# EAGLE schematic MotherboardRev2 (EAGLE 7.2.0)

## Sheet 1 of 12
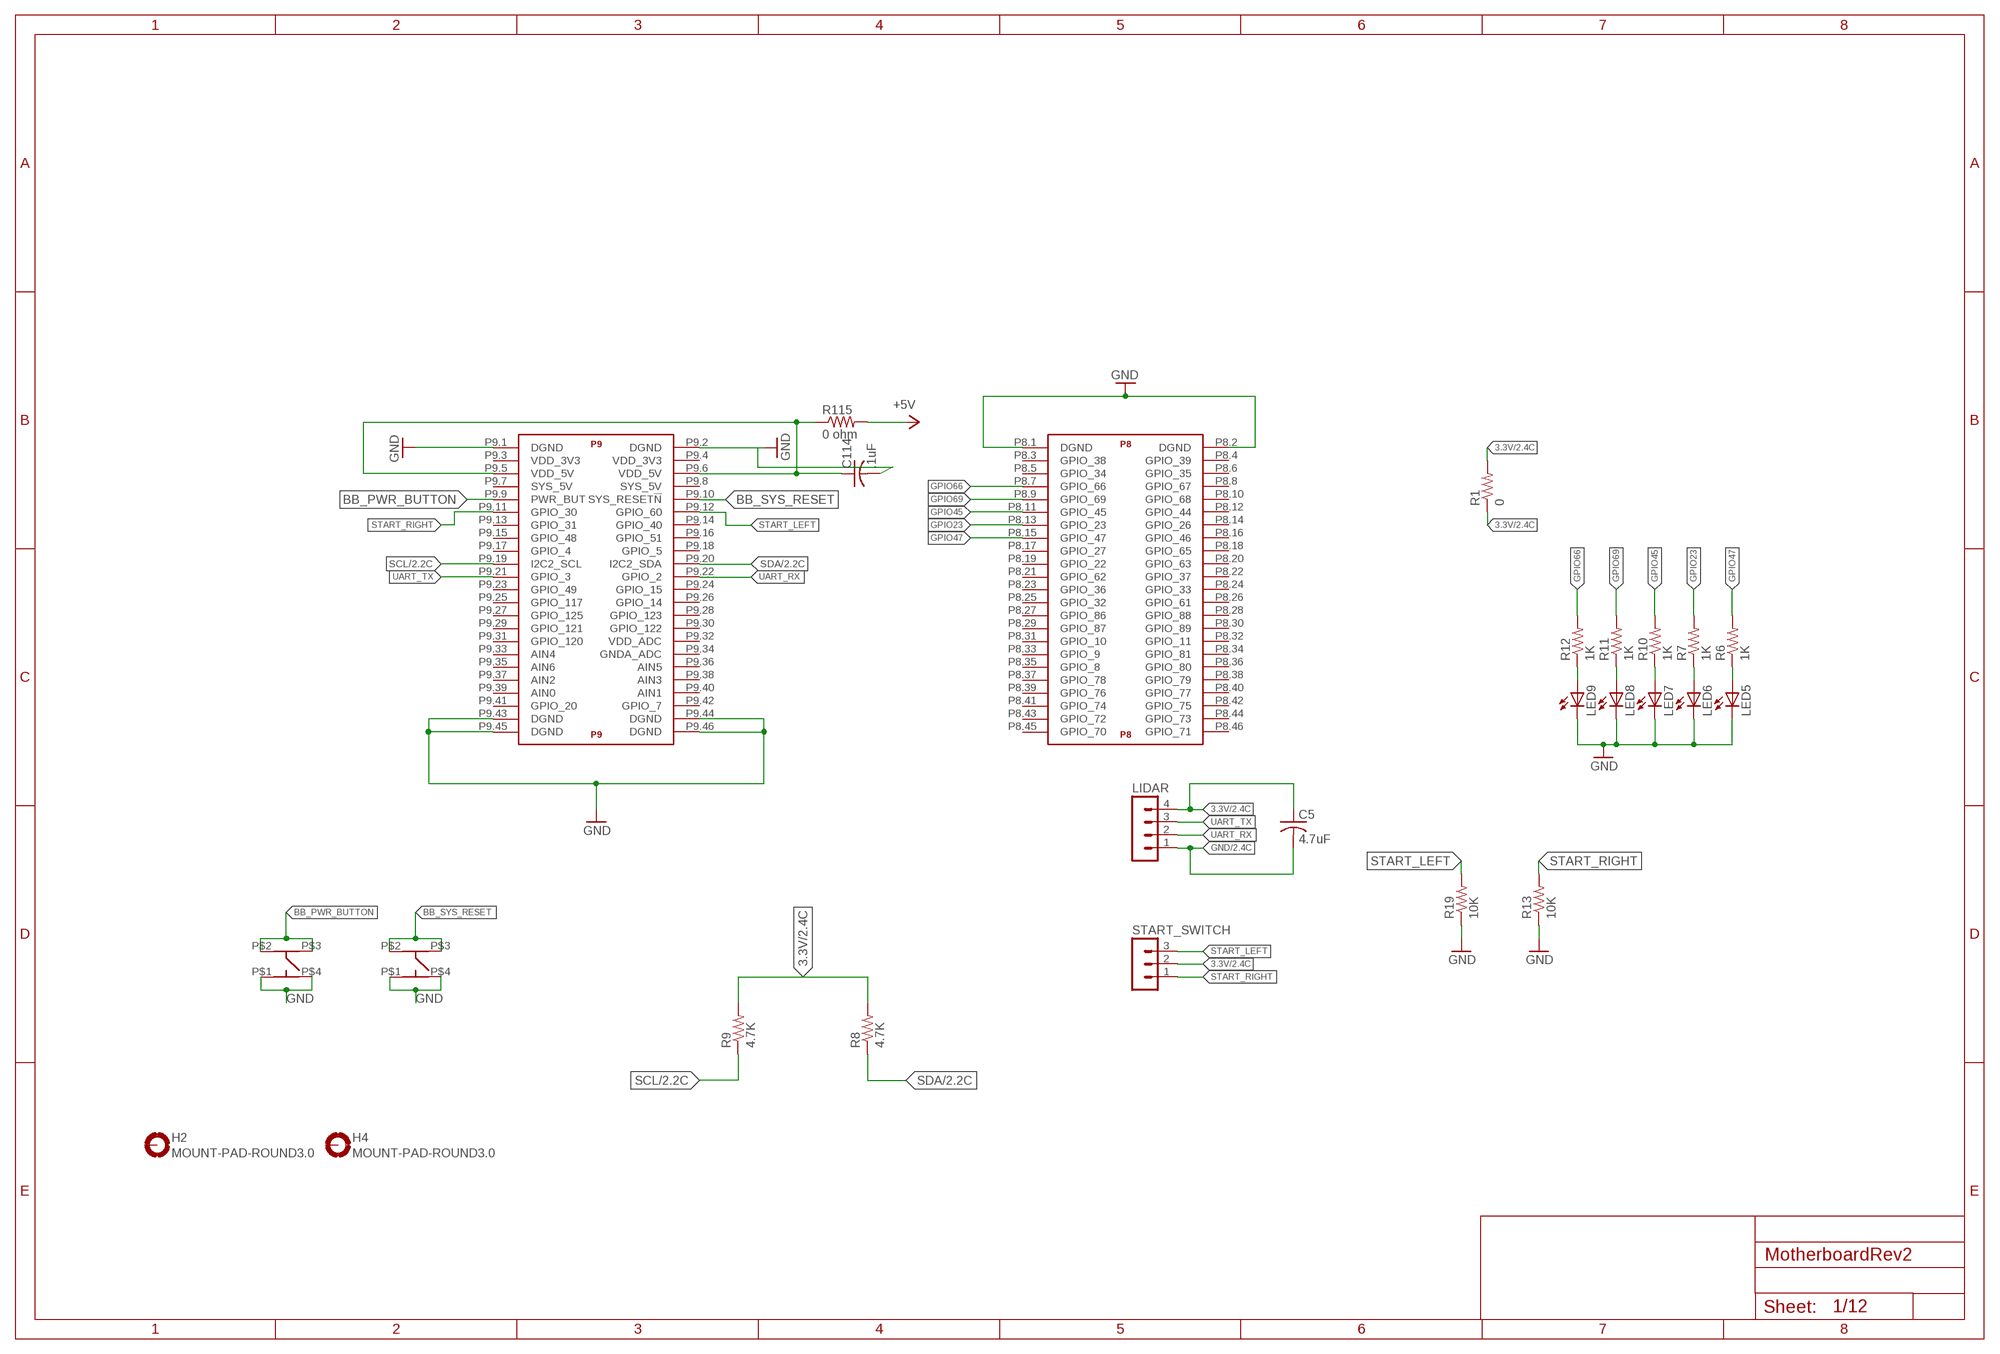
[diagram p0: schematic, sheet 1]

### Parts
C5  4.7uF  C-USC0402  [C0402]
C114  .1uF  C-USC0402  [C0402]
H2  MOUNT-PAD-ROUND3.0  [3,0-PAD]
H4  MOUNT-PAD-ROUND3.0  [3,0-PAD]
LED5  LEDCHIP-LED0603  [CHIP-LED0603]
LED6  LEDCHIP-LED0603  [CHIP-LED0603]
LED7  LEDCHIP-LED0603  [CHIP-LED0603]
LED8  LEDCHIP-LED0603  [CHIP-LED0603]
LED9  LEDCHIP-LED0603  [CHIP-LED0603]
LIDAR  MA04-1  [MA04-1]
R1  0  R-US_R0805  [R0805]
R6  1K  R-US_R0402  [R0402]
R7  1K  R-US_R0402  [R0402]
R8  4.7K  R-US_R0402  [R0402]
R9  4.7K  R-US_R0402  [R0402]
R10  1K  R-US_R0402  [R0402]
R11  1K  R-US_R0402  [R0402]
R12  1K  R-US_R0402  [R0402]
R13  10K  R-US_R0402  [R0402]
R19  10K  R-US_R0402  [R0402]
R115  0 ohm  R-US_R0805  [R0805]
START_SWITCH  MA03-1  [MA03-1]
U$5  BEAGLE_BONE_BLACK_CAPE  [BEAGLE_BONE_BLACK_CAPE]
U$100  Switch1  MC32882_SW  [MC32882_FINAL]
U$101  Switch1  MC32882_SW  [MC32882_FINAL]

### Nets
3.3V: C5.1 LIDAR.4 R1.1 R1.2 R8.2 R9.2 START_SWITCH.2 ; also sheet 2,3,9,10
BB_PWR_BUTTON: U$5.P9.9(P9:PWR_BUT) U$101.P$2(P2) U$101.P$3(P3)
BB_SYS_RESET: U$5.P9.10(P9:SYS_RESET!N) U$100.P$2(P2) U$100.P$3(P3)
GND: C5.2 C114.2 LED5.C LED6.C LED7.C LED8.C LED9.C LIDAR.1 R13.1 R19.1 U$5.P8.1(P8:DGND) U$5.P8.2(P8:DGND) U$5.P9.1(P9:DGND) U$5.P9.2(P9:DGND) U$5.P9.43(P9:DGND) U$5.P9.44(P9:DGND) U$5.P9.45(P9:DGND) U$5.P9.46(P9:DGND) U$100.P$1(P1) U$100.P$4(P4) U$101.P$1(P1) U$101.P$4(P4) ; also sheet 2,3,4,5,6,7,8,9,10,11
GPIO23: R7.2 U$5.P8.13(P8:GPIO_23)
GPIO45: R10.2 U$5.P8.11(P8:GPIO_45)
GPIO47: R6.2 U$5.P8.15(P8:GPIO_47)
GPIO66: R12.2 U$5.P8.7(P8:GPIO_66)
GPIO69: R11.2 U$5.P8.9(P8:GPIO_69)
N$18: C114.1 R115.1 U$5.P9.5(P9:VDD_5V) U$5.P9.6(P9:VDD_5V)
N$55: LED9.A R12.1
N$56: LED8.A R11.1
N$57: LED7.A R10.1
N$58: LED6.A R7.1
N$59: LED5.A R6.1
SCL: R9.1 U$5.P9.19(P9:I2C2_SCL) ; also sheet 2,10
SDA: R8.1 U$5.P9.20(P9:I2C2_SDA) ; also sheet 2,10
START_LEFT: R19.2 START_SWITCH.3 U$5.P9.12(P9:GPIO_60)
START_RIGHT: R13.2 START_SWITCH.1 U$5.P9.11(P9:GPIO_30)
UART_RX: LIDAR.2 U$5.P9.22(P9:GPIO_2)
UART_TX: LIDAR.3 U$5.P9.21(P9:GPIO_3)
VOUT1: R115.2 ; supply symbol labelled +5V ; also sheet 3,4,5
Unconnected: H2.B3,0(MOUNT) H4.B3,0(MOUNT) U$5.P8.3(P8:GPIO_38) U$5.P8.4(P8:GPIO_39) U$5.P8.5(P8:GPIO_34) U$5.P8.6(P8:GPIO_35) U$5.P8.8(P8:GPIO_67) U$5.P8.10(P8:GPIO_68) U$5.P8.12(P8:GPIO_44) U$5.P8.14(P8:GPIO_26) U$5.P8.16(P8:GPIO_46) U$5.P8.17(P8:GPIO_27) U$5.P8.18(P8:GPIO_65) U$5.P8.19(P8:GPIO_22) U$5.P8.20(P8:GPIO_63) U$5.P8.21(P8:GPIO_62) U$5.P8.22(P8:GPIO_37) U$5.P8.23(P8:GPIO_36) U$5.P8.24(P8:GPIO_33) U$5.P8.25(P8:GPIO_32) U$5.P8.26(P8:GPIO_61) U$5.P8.27(P8:GPIO_86) U$5.P8.28(P8:GPIO_88) U$5.P8.29(P8:GPIO_87) U$5.P8.30(P8:GPIO_89) U$5.P8.31(P8:GPIO_10) U$5.P8.32(P8:GPIO_11) U$5.P8.33(P8:GPIO_9) U$5.P8.34(P8:GPIO_81) U$5.P8.35(P8:GPIO_8) U$5.P8.36(P8:GPIO_80) U$5.P8.37(P8:GPIO_78) U$5.P8.38(P8:GPIO_79) U$5.P8.39(P8:GPIO_76) U$5.P8.40(P8:GPIO_77) U$5.P8.41(P8:GPIO_74) U$5.P8.42(P8:GPIO_75) U$5.P8.43(P8:GPIO_72) U$5.P8.44(P8:GPIO_73) U$5.P8.45(P8:GPIO_70) U$5.P8.46(P8:GPIO_71) U$5.P9.3(P9:VDD_3V3) U$5.P9.4(P9:VDD_3V3) U$5.P9.7(P9:SYS_5V) U$5.P9.8(P9:SYS_5V) U$5.P9.13(P9:GPIO_31) U$5.P9.14(P9:GPIO_40) U$5.P9.15(P9:GPIO_48) U$5.P9.16(P9:GPIO_51) U$5.P9.17(P9:GPIO_4) U$5.P9.18(P9:GPIO_5) U$5.P9.23(P9:GPIO_49) U$5.P9.24(P9:GPIO_15) U$5.P9.25(P9:GPIO_117) U$5.P9.26(P9:GPIO_14) U$5.P9.27(P9:GPIO_125) U$5.P9.28(P9:GPIO_123) U$5.P9.29(P9:GPIO_121) U$5.P9.30(P9:GPIO_122) U$5.P9.31(P9:GPIO_120) U$5.P9.32(P9:VDD_ADC) U$5.P9.33(P9:AIN4) U$5.P9.34(P9:GNDA_ADC) U$5.P9.35(P9:AIN6) U$5.P9.36(P9:AIN5) U$5.P9.37(P9:AIN2) U$5.P9.38(P9:AIN3) U$5.P9.39(P9:AIN0) U$5.P9.40(P9:AIN1) U$5.P9.41(P9:GPIO_20) U$5.P9.42(P9:GPIO_7)

## Sheet 2 of 12
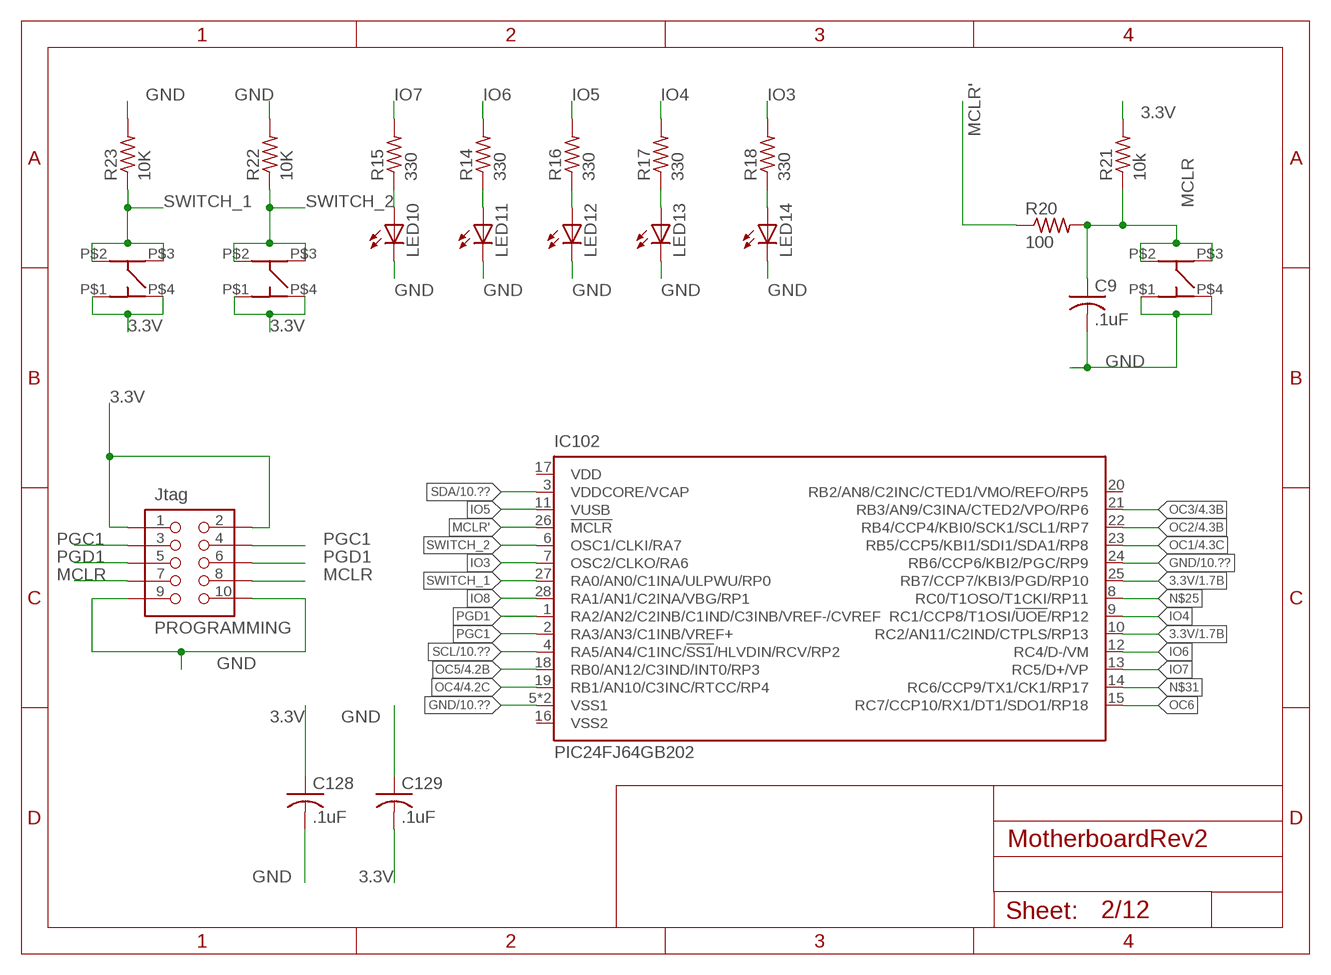
[diagram p1: schematic, sheet 2]

### Parts
C9  .1uF  C-USC0402  [C0402]
C128  .1uF  C-USC0402  [C0402]
C129  .1uF  C-USC0402  [C0402]
IC102  PIC24FJ64GB202  PIC18F26J53ML  [QFN28-ML_6X6MM]
LED10  LEDCHIP-LED0603  [CHIP-LED0603]
LED11  LEDCHIP-LED0603  [CHIP-LED0603]
LED12  LEDCHIP-LED0603  [CHIP-LED0603]
LED13  LEDCHIP-LED0603  [CHIP-LED0603]
LED14  LEDCHIP-LED0603  [CHIP-LED0603]
PROGRAMMING  Jtag  MOTHER-BOARD-REV5_PIN-CONNECTOR74089  [MOTHER-BOARD-REV5_10-PIN-SMD]
R14  330  R-US_R0402  [R0402]
R15  330  R-US_R0402  [R0402]
R16  330  R-US_R0402  [R0402]
R17  330  R-US_R0402  [R0402]
R18  330  R-US_R0402  [R0402]
R20  100  R-US_R0402  [R0402]
R21  10k  R-US_R0402  [R0402]
R22  10K  R-US_R0402  [R0402]
R23  10K  R-US_R0402  [R0402]
U$3  Switch2  MC32882_SW  [MC32882_FINAL]
U$4  Switch1  MC32882_SW  [MC32882_FINAL]
U$102  Switch3  MC32882_SW  [MC32882_FINAL]

### Nets
3.3V: C128.1 C129.1 IC102.10(RC2/AN11/C2IND/CTPLS/RP13) IC102.25(RB7/CCP7/KBI3/PGD/RP10) PROGRAMMING.1 PROGRAMMING.2 R21.2 U$3.P$1(P1) U$3.P$4(P4) U$4.P$1(P1) U$4.P$4(P4) ; also sheet 1,3,9,10
GND: C9.2 C128.2 C129.2 IC102.5(VSS1) IC102.24(RB6/CCP6/KBI2/PGC/RP9) IC102.EXP(VSS1) LED10.C LED11.C LED12.C LED13.C LED14.C PROGRAMMING.9 PROGRAMMING.10 R22.2 R23.2 U$102.P$1(P1) U$102.P$4(P4) ; also sheet 1,3,4,5,6,7,8,9,10,11
IO3: IC102.7(OSC2/CLKO/RA6) R18.2
IO4: IC102.9(RC1/CCP8/T1OSI/!UOE!/RP12) R17.2
IO5: IC102.11(VUSB) R16.2
IO6: IC102.12(RC4/D-/VM) R14.2
IO7: IC102.13(RC5/D+/VP) R15.2
IO8: IC102.28(RA1/AN1/C2INA/VBG/RP1)
MCLR: C9.1 PROGRAMMING.7 PROGRAMMING.8 R20.2 R21.1 U$102.P$2(P2) U$102.P$3(P3)
MCLR': IC102.26(!MCLR) R20.1
N$5: LED10.A R15.1
N$6: LED11.A R14.1
N$7: LED12.A R16.1
N$8: LED13.A R17.1
N$9: LED14.A R18.1
N$25: IC102.8(RC0/T1OSO/T1CKI/RP11)
N$31: IC102.14(RC6/CCP9/TX1/CK1/RP17)
OC1: IC102.23(RB5/CCP5/KBI1/SDI1/SDA1/RP8) ; also sheet 4
OC2: IC102.22(RB4/CCP4/KBI0/SCK1/SCL1/RP7) ; also sheet 4
OC3: IC102.21(RB3/AN9/C3INA/CTED2/VPO/RP6) ; also sheet 4
OC4: IC102.19(RB1/AN10/C3INC/RTCC/RP4) ; also sheet 4
OC5: IC102.18(RB0/AN12/C3IND/INT0/RP3) ; also sheet 4
OC6: IC102.15(RC7/CCP10/RX1/DT1/SDO1/RP18) ; also sheet 4
PGC1: IC102.2(RA3/AN3/C1INB/VREF+) PROGRAMMING.3 PROGRAMMING.4
PGD1: IC102.1(RA2/AN2/C2INB/C1IND/C3INB/VREF-/CVREF) PROGRAMMING.5 PROGRAMMING.6
SCL: IC102.4(RA5/AN4/C1INC/!SS1!/HLVDIN/RCV/RP2) ; also sheet 1,10
SDA: IC102.3(VDDCORE/VCAP) ; also sheet 1,10
SWITCH_1: IC102.27(RA0/AN0/C1INA/ULPWU/RP0) R23.1 U$4.P$2(P2) U$4.P$3(P3)
SWITCH_2: IC102.6(OSC1/CLKI/RA7) R22.1 U$3.P$2(P2) U$3.P$3(P3)
Unconnected: IC102.16(VSS2) IC102.17(VDD) IC102.20(RB2/AN8/C2INC/CTED1/VMO/REFO/RP5)

## Sheet 3 of 12: Power System
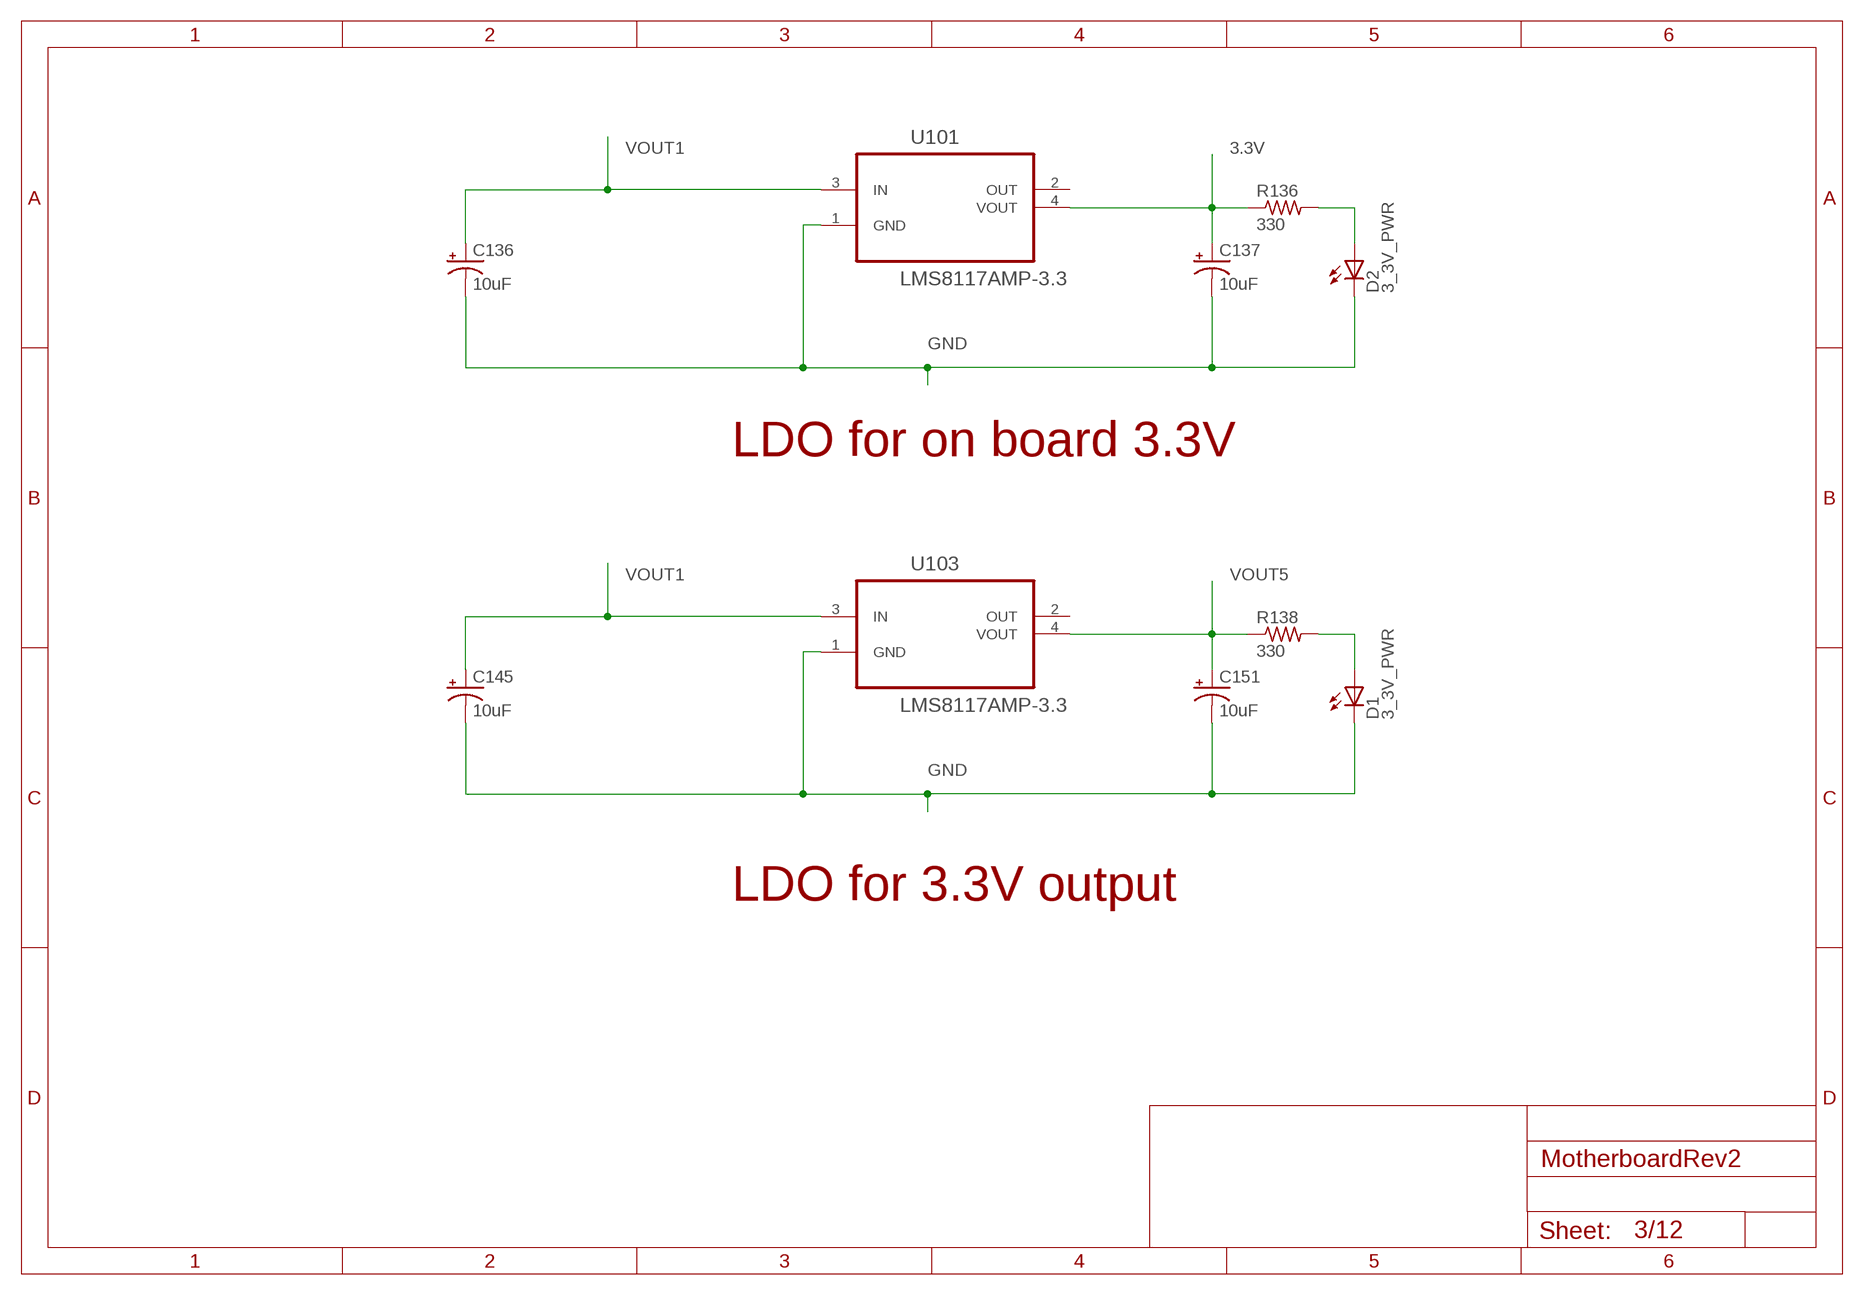
[diagram p2: schematic, sheet 3]

### Parts
C136  10uF  10UF-16V-10%(TANT)  [EIA3216]
C137  10uF  10UF-16V-10%(TANT)  [EIA3216]
C145  10uF  10UF-16V-10%(TANT)  [EIA3216]
C151  10uF  10UF-16V-10%(TANT)  [EIA3216]
D1  3_3V_PWR  LEDCHIP-LED0603  [CHIP-LED0603]
D2  3_3V_PWR  LEDCHIP-LED0603  [CHIP-LED0603]
R136  330  R-US_R0402  [R0402]
R138  330  R-US_R0402  [R0402]
U101  LMS8117AMP-3.3  [SOT230P696X180-4N]
U103  LMS8117AMP-3.3  [SOT230P696X180-4N]

### Nets
3.3V: C137.A(+) R136.1 U101.4(VOUT) ; also sheet 1,2,9,10
GND: C136.C(-) C137.C(-) C145.C(-) C151.C(-) D1.C D2.C U101.1(GND) U103.1(GND) ; also sheet 1,2,4,5,6,7,8,9,10,11
N$10: D2.A R136.2
N$11: D1.A R138.2
VOUT1: C136.A(+) C145.A(+) U101.3(IN) U103.3(IN) ; also sheet 1,4,5
VOUT5: C151.A(+) R138.1 U103.4(VOUT) ; also sheet 4
Unconnected: U101.2(OUT) U103.2(OUT)

### Notes on the sheet
- LDO for on board 3.3V
- LDO for 3.3V output

## Sheet 4 of 12
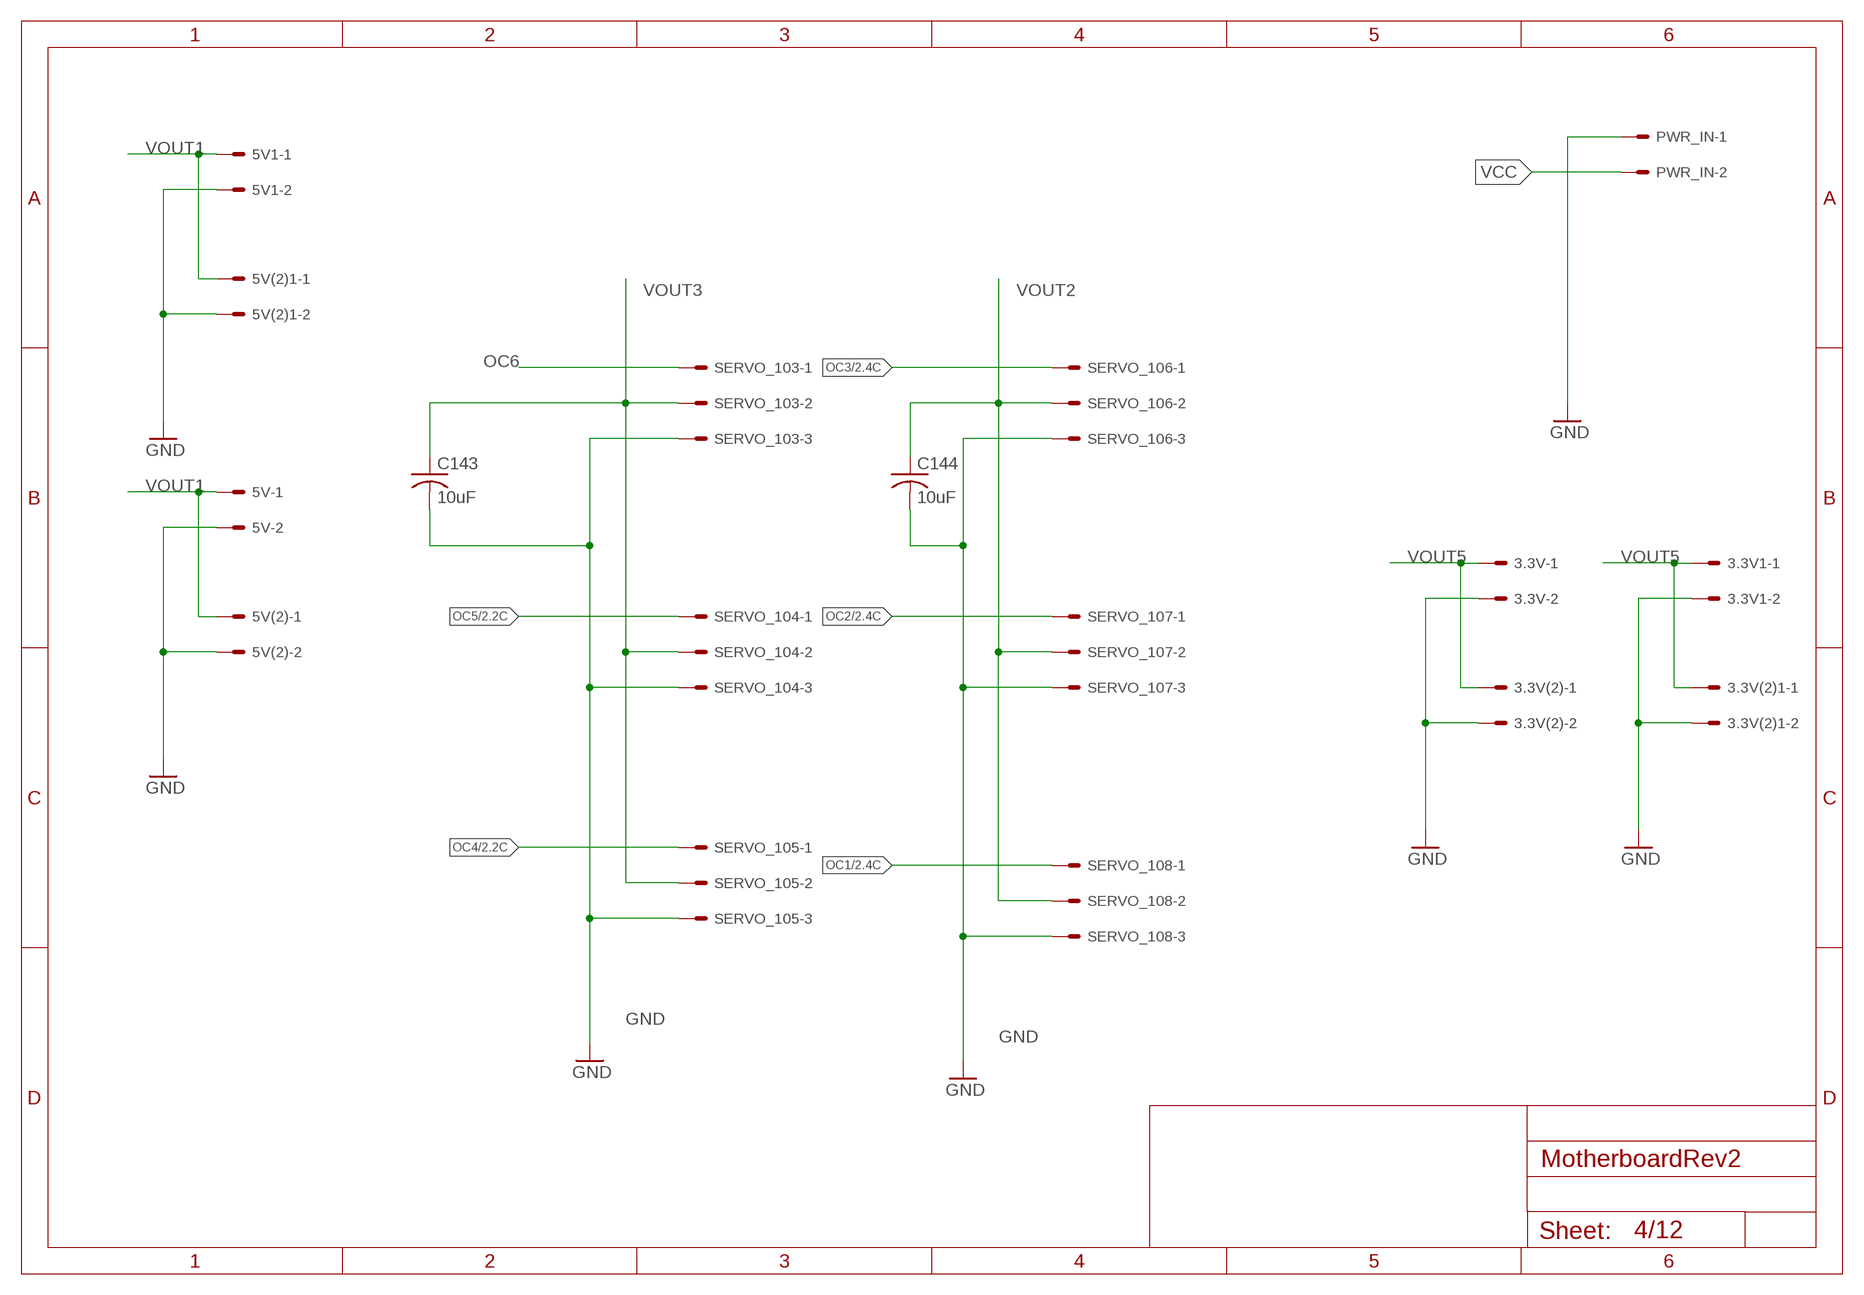
[diagram p3: schematic, sheet 4]

### Parts
3.3V  22-05-7028-02  [7395-02]
3.3V1  22-05-7028-02  [7395-02]
3.3V(2)  22-05-7028-02  [7395-02]
3.3V(2)1  22-05-7028-02  [7395-02]
5V  22-05-7028-02  [7395-02]
5V1  22-05-7028-02  [7395-02]
5V(2)  22-05-7028-02  [7395-02]
5V(2)1  22-05-7028-02  [7395-02]
C143  10uF  C-USC0805  [C0805]
C144  10uF  C-USC0805  [C0805]
PWR_IN  555X-2H  [5569-2]
SERVO_103  22-05-7038-03  [7395-03]
SERVO_104  22-05-7038-03  [7395-03]
SERVO_105  22-05-7038-03  [7395-03]
SERVO_106  22-05-7038-03  [7395-03]
SERVO_107  22-05-7038-03  [7395-03]
SERVO_108  22-05-7038-03  [7395-03]

### Nets
GND: 3.3V1.2 3.3V(2)1.2 3.3V(2).2 3.3V.2 5V1.2 5V(2)1.2 5V(2).2 5V.2 C143.2 C144.2 PWR_IN.1 SERVO_103.3 SERVO_104.3 SERVO_105.3 SERVO_106.3 SERVO_107.3 SERVO_108.3 ; also sheet 1,2,3,5,6,7,8,9,10,11
OC1: SERVO_108.1 ; also sheet 2
OC2: SERVO_107.1 ; also sheet 2
OC3: SERVO_106.1 ; also sheet 2
OC4: SERVO_105.1 ; also sheet 2
OC5: SERVO_104.1 ; also sheet 2
OC6: SERVO_103.1 ; also sheet 2
VCC: PWR_IN.2 ; also sheet 5,6,7,10,11
VOUT1: 5V1.1 5V(2)1.1 5V(2).1 5V.1 ; also sheet 1,3,5
VOUT2: C144.1 SERVO_106.2 SERVO_107.2 SERVO_108.2 ; also sheet 6
VOUT3: C143.1 SERVO_103.2 SERVO_104.2 SERVO_105.2 ; also sheet 7
VOUT5: 3.3V1.1 3.3V(2)1.1 3.3V(2).1 3.3V.1 ; also sheet 3

## Sheet 5 of 12
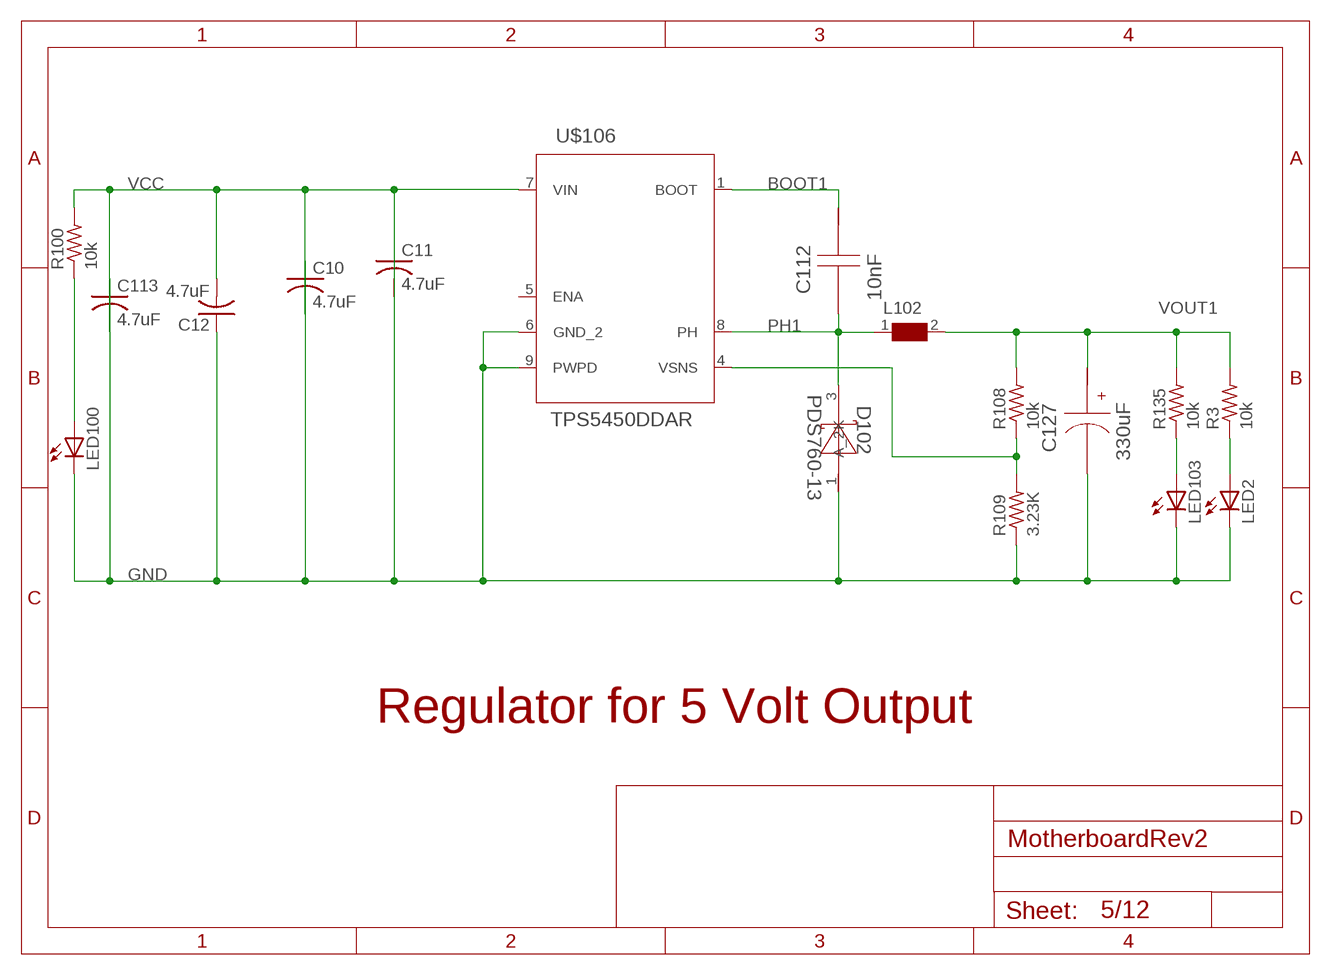
[diagram p4: schematic, sheet 5]

### Parts
C10  4.7uF  C-USC0805  [C0805]
C11  4.7uF  C-USC0805  [C0805]
C12  4.7uF  C-USC0805  [C0805]
C112  10nF  C0805C103K5RACTU  [0805]
C113  4.7uF  C-USC0805  [C0805]
C127  330uF  10SVP330MX  [SM_RADIAL_10AMM]
D102  PDS760-13  [POWERDI5]
L102  WE-HCC-7443331000_1090  [WE-HCC_1090]
LED2  LEDCHIP-LED0603  [CHIP-LED0603]
LED100  LEDCHIP-LED0603  [CHIP-LED0603]
LED103  LEDCHIP-LED0603  [CHIP-LED0603]
R3  10k  R-US_R0402  [R0402]
R100  10k  R-US_R0402  [R0402]
R108  10k  R-US_R0402  [R0402]
R109  3.23K  R-US_R0402  [R0402]
R135  10k  R-US_R0402  [R0402]
U$106  TPS5450DDAR  [R-PDSO-G8]

### Nets
BOOT1: C112.1 U$106.1(BOOT)
GND: C10.1 C11.1 C12.1 C113.1 C127.2(-) D102.1(A_2) LED2.C LED100.C LED103.C R109.1 U$106.6(GND_2) U$106.9(PWPD) ; also sheet 1,2,3,4,6,7,8,9,10,11
N$1: LED103.A R135.1
N$19: LED100.A R100.1
N$62: LED2.A R3.1
PH1: C112.2 D102.3(K) L102.1 U$106.8(PH)
VCC: C10.2 C11.2 C12.2 C113.2 R100.2 U$106.7(VIN) ; also sheet 4,6,7,10,11
VOUT1: C127.1(+) L102.2 R3.2 R108.2 R135.2 ; also sheet 1,3,4
VSNS1: R108.1 R109.2 U$106.4(VSNS)
Unconnected: U$106.5(ENA)

### Notes on the sheet
- Regulator for 5 Volt Output

## Sheet 6 of 12
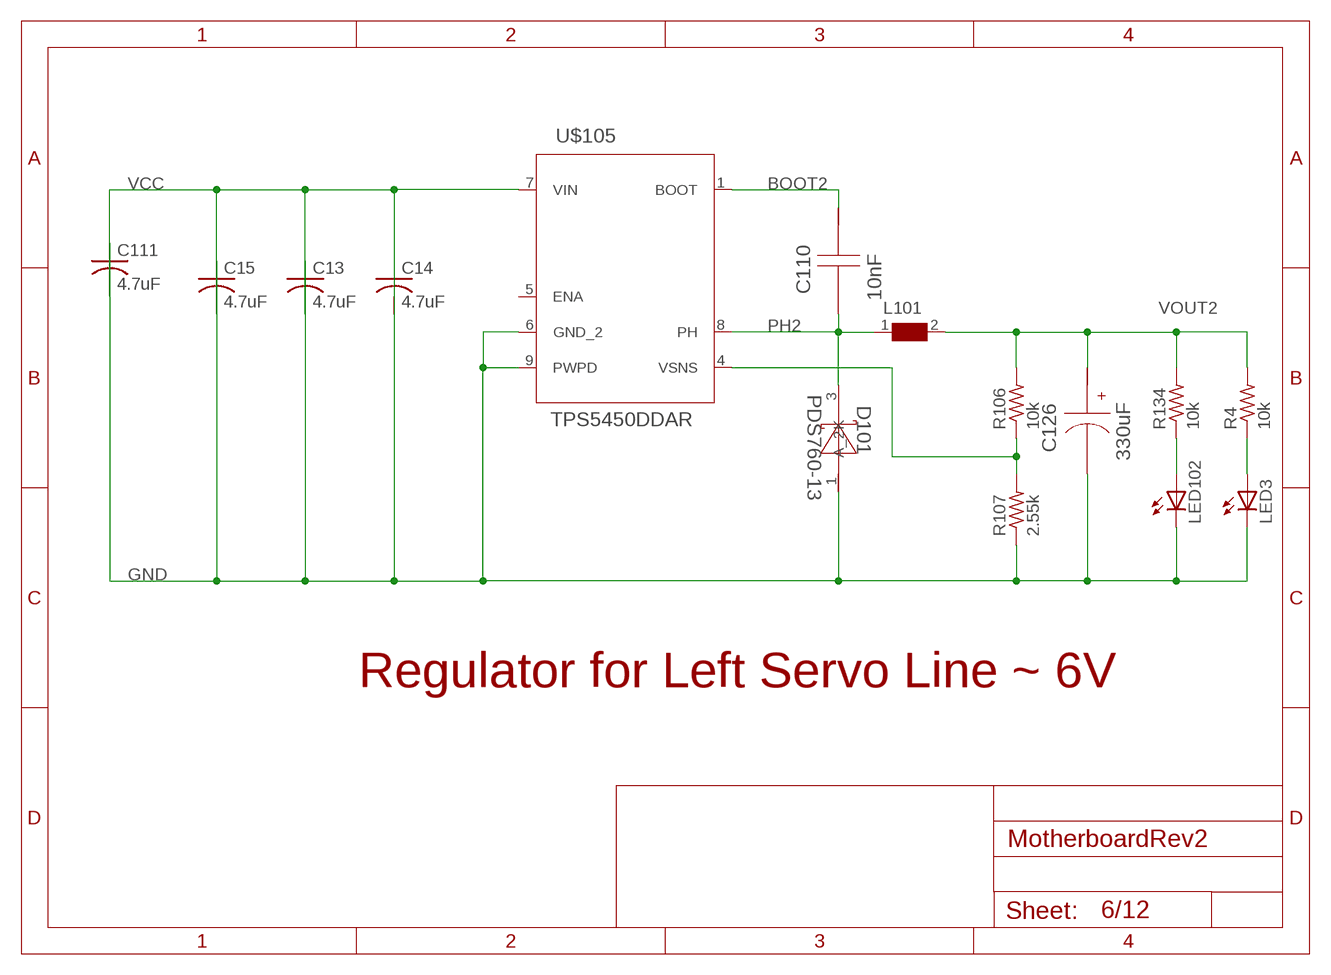
[diagram p5: schematic, sheet 6]

### Parts
C13  4.7uF  C-USC0805  [C0805]
C14  4.7uF  C-USC0805  [C0805]
C15  4.7uF  C-USC0805  [C0805]
C110  10nF  C0805C103K5RACTU  [0805]
C111  4.7uF  C-USC0805  [C0805]
C126  330uF  10SVP330MX  [SM_RADIAL_10AMM]
D101  PDS760-13  [POWERDI5]
L101  WE-HCC-7443331000_1090  [WE-HCC_1090]
LED3  LEDCHIP-LED0603  [CHIP-LED0603]
LED102  LEDCHIP-LED0603  [CHIP-LED0603]
R4  10k  R-US_R0402  [R0402]
R106  10k  R-US_R0402  [R0402]
R107  2.55k  R-US_R0402  [R0402]
R134  10k  R-US_R0402  [R0402]
U$105  TPS5450DDAR  [R-PDSO-G8]

### Nets
BOOT2: C110.1 U$105.1(BOOT)
GND: C13.1 C14.1 C15.1 C111.1 C126.2(-) D101.1(A_2) LED3.C LED102.C R107.1 U$105.6(GND_2) U$105.9(PWPD) ; also sheet 1,2,3,4,5,7,8,9,10,11
N$2: LED102.A R134.1
N$60: LED3.A R4.1
PH2: C110.2 D101.3(K) L101.1 U$105.8(PH)
VCC: C13.2 C14.2 C15.2 C111.2 U$105.7(VIN) ; also sheet 4,5,7,10,11
VOUT2: C126.1(+) L101.2 R4.2 R106.2 R134.2 ; also sheet 4
VSNS2: R106.1 R107.2 U$105.4(VSNS)
Unconnected: U$105.5(ENA)

### Notes on the sheet
- Regulator for Left Servo Line ~ 6V

## Sheet 7 of 12
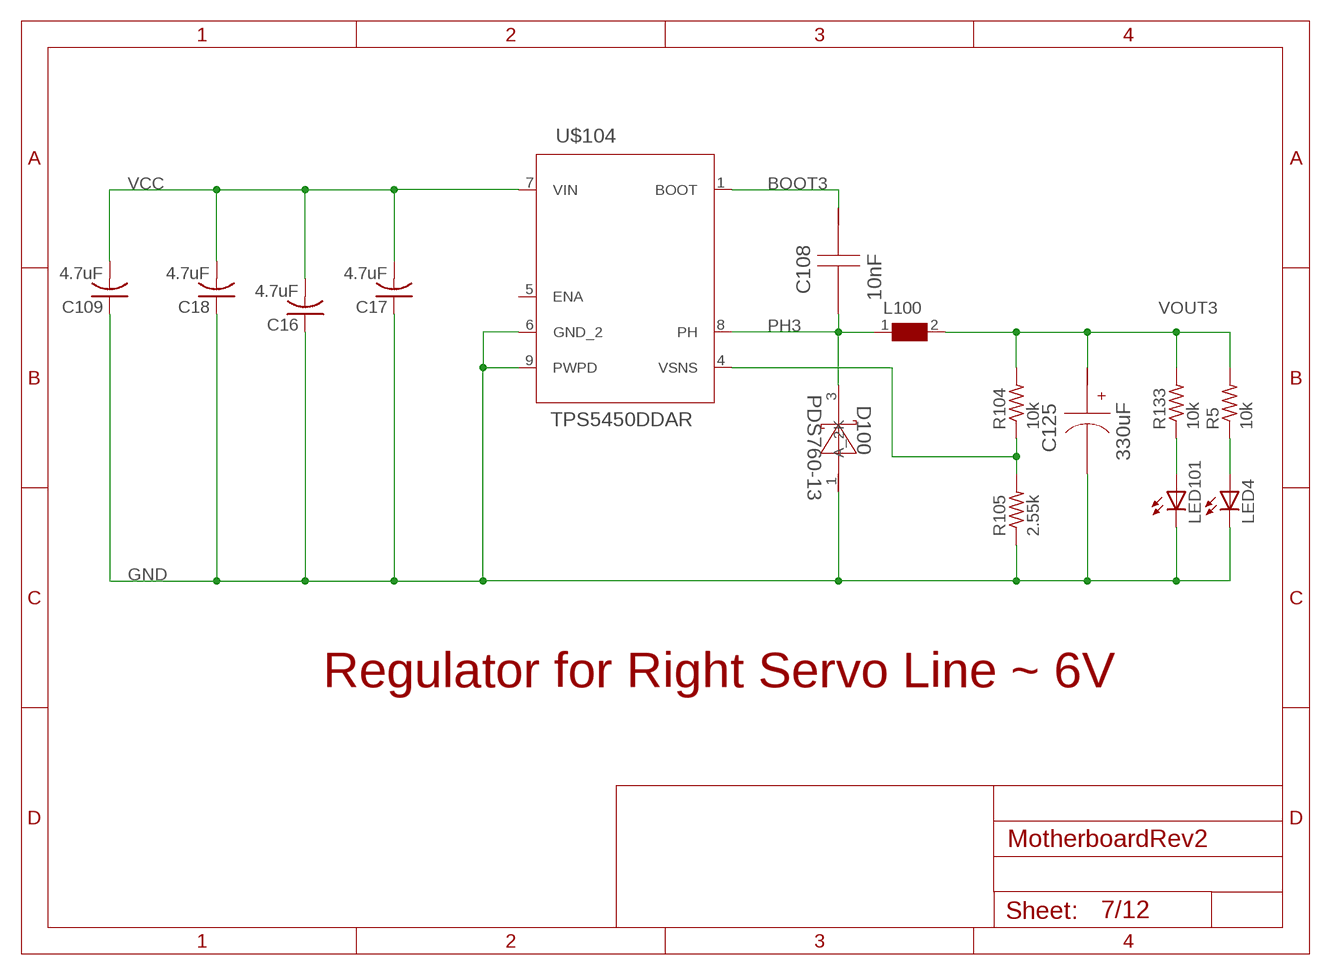
[diagram p6: schematic, sheet 7]

### Parts
C16  4.7uF  C-USC0805  [C0805]
C17  4.7uF  C-USC0805  [C0805]
C18  4.7uF  C-USC0805  [C0805]
C108  10nF  C0805C103K5RACTU  [0805]
C109  4.7uF  C-USC0805  [C0805]
C125  330uF  10SVP330MX  [SM_RADIAL_10AMM]
D100  PDS760-13  [POWERDI5]
L100  WE-HCC-7443331000_1090  [WE-HCC_1090]
LED4  LEDCHIP-LED0603  [CHIP-LED0603]
LED101  LEDCHIP-LED0603  [CHIP-LED0603]
R5  10k  R-US_R0402  [R0402]
R104  10k  R-US_R0402  [R0402]
R105  2.55k  R-US_R0402  [R0402]
R133  10k  R-US_R0402  [R0402]
U$104  TPS5450DDAR  [R-PDSO-G8]

### Nets
BOOT3: C108.1 U$104.1(BOOT)
GND: C16.1 C17.1 C18.1 C109.1 C125.2(-) D100.1(A_2) LED4.C LED101.C R105.1 U$104.6(GND_2) U$104.9(PWPD) ; also sheet 1,2,3,4,5,6,8,9,10,11
N$3: LED101.A R133.1
N$61: LED4.A R5.1
PH3: C108.2 D100.3(K) L100.1 U$104.8(PH)
VCC: C16.2 C17.2 C18.2 C109.2 U$104.7(VIN) ; also sheet 4,5,6,10,11
VOUT3: C125.1(+) L100.2 R5.2 R104.2 R133.2 ; also sheet 4
VSNS3: R104.1 R105.2 U$104.4(VSNS)
Unconnected: U$104.5(ENA)

### Notes on the sheet
- Regulator for Right Servo Line ~ 6V

## Sheet 8 of 12
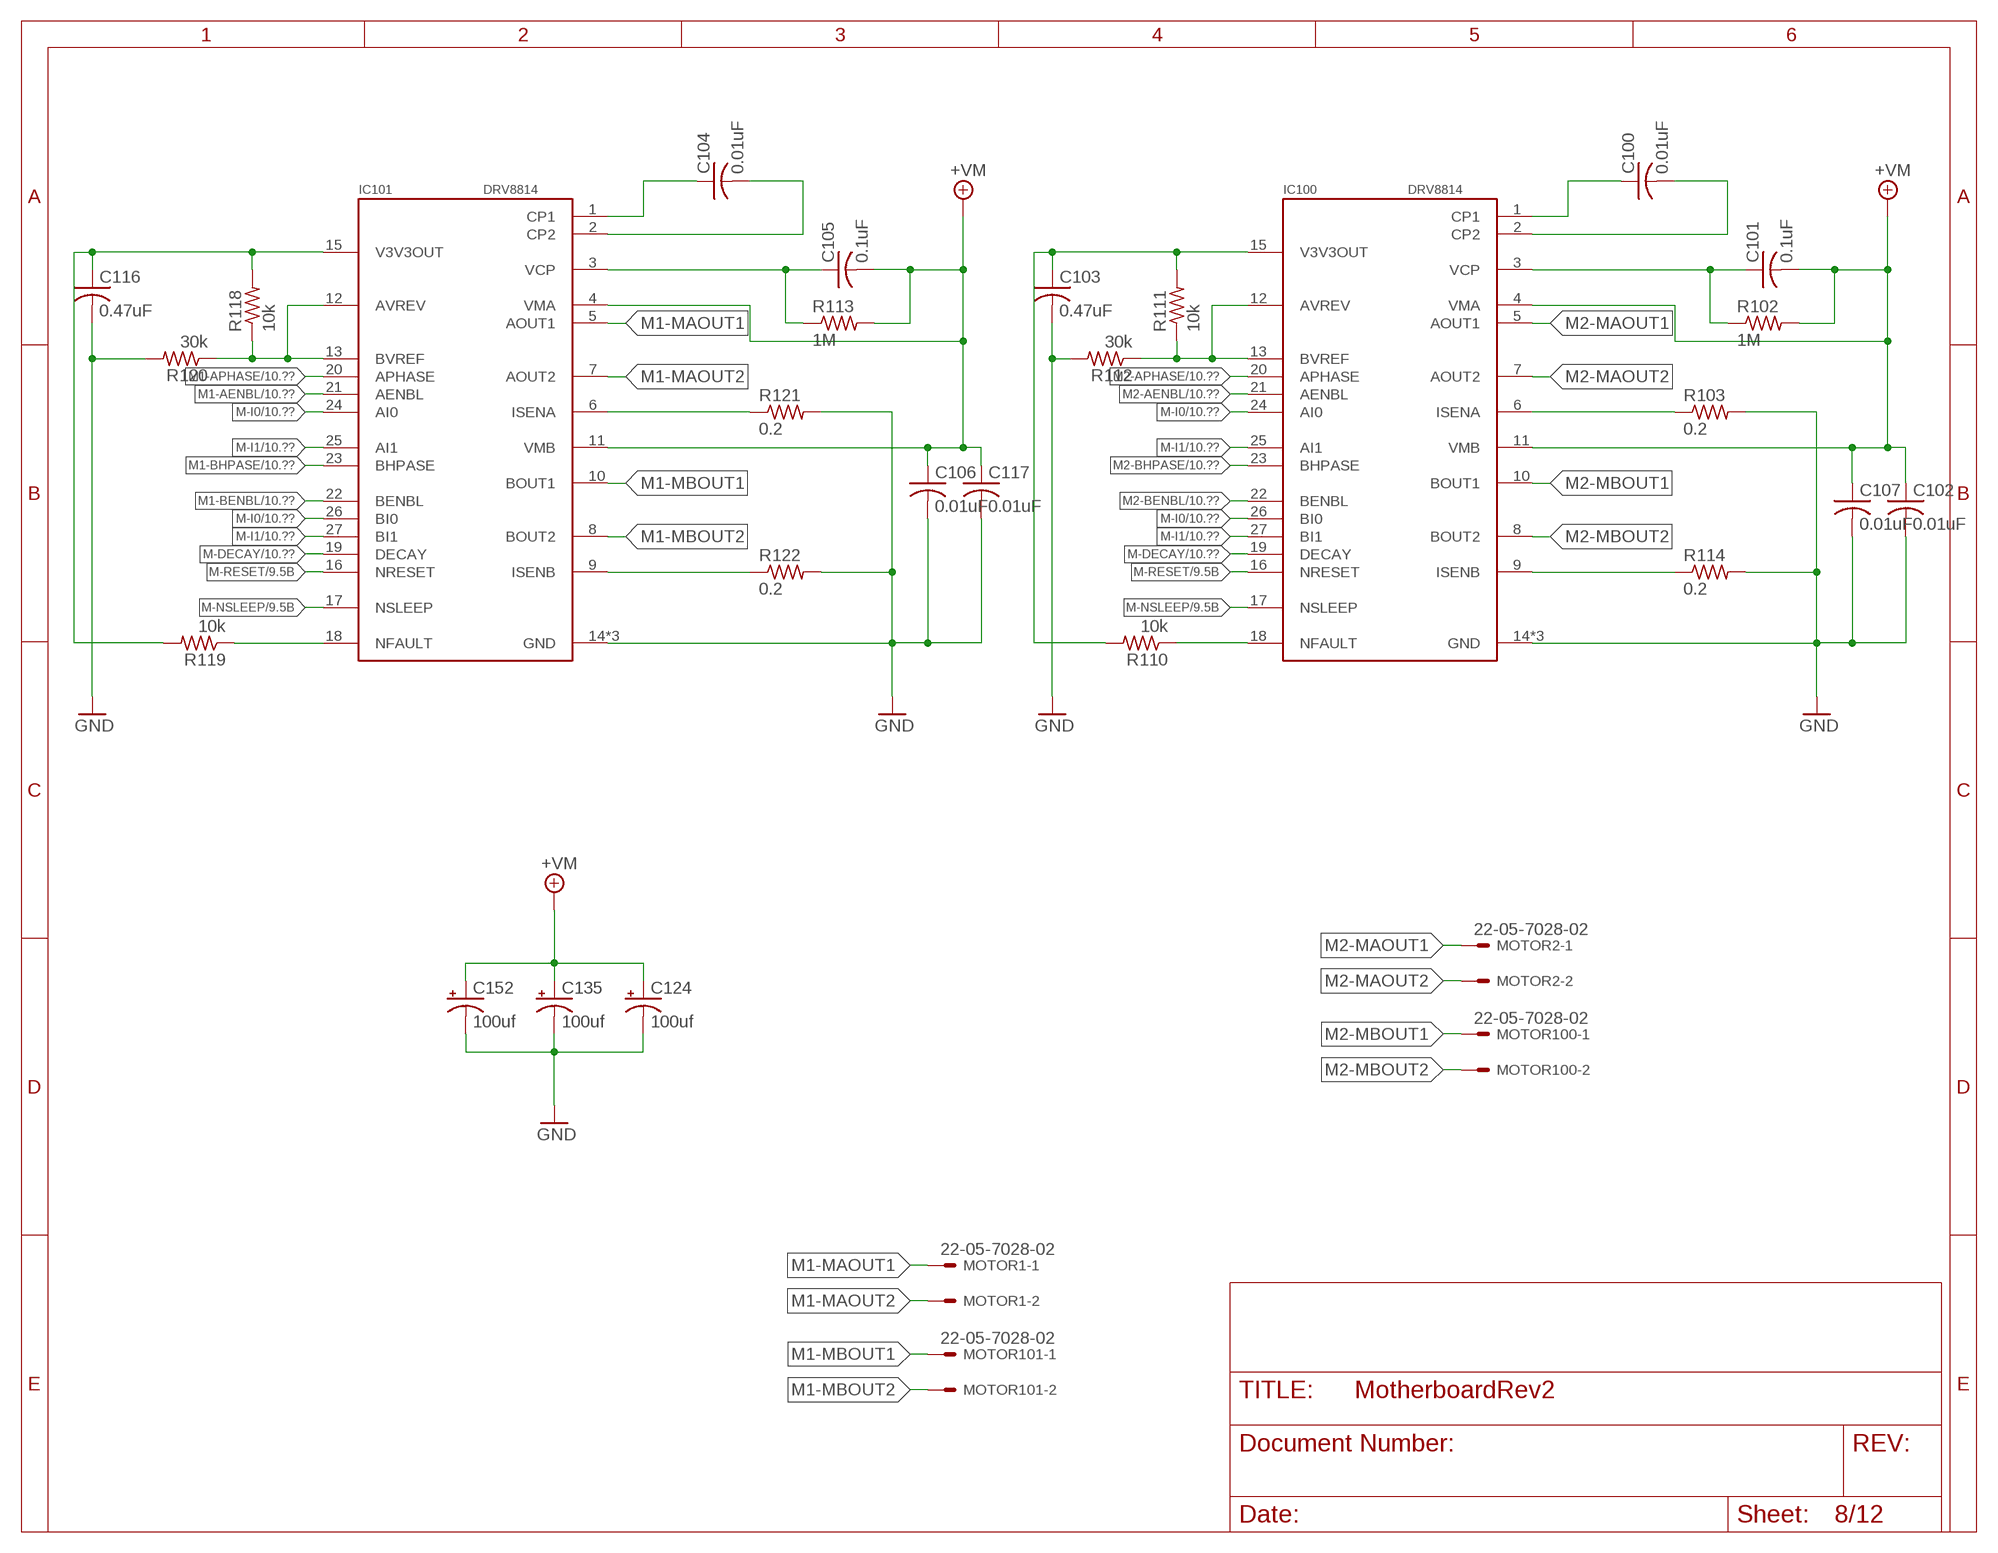
[diagram p7: schematic, sheet 8]

### Parts
C100  0.01uF  C-USC0402  [C0402]
C101  0.1uF  C-USC0402  [C0402]
C102  0.01uF  C-USC0402  [C0402]
C103  0.47uF  C-USC0402  [C0402]
C104  0.01uF  C-USC0402  [C0402]
C105  0.1uF  C-USC0402  [C0402]
C106  0.01uF  C-USC0402  [C0402]
C107  0.01uF  C-USC0402  [C0402]
C116  0.47uF  C-USC0402  [C0402]
C117  0.01uF  C-USC0402  [C0402]
C124  100uf  CPOL-US153CLV-0605  [153CLV-0605]
C135  100uf  CPOL-US153CLV-0605  [153CLV-0605]
C152  100uf  CPOL-US153CLV-0605  [153CLV-0605]
IC100  DRV8814  DRV8818PWPR  [TSSOP-28]
IC101  DRV8814  DRV8818PWPR  [TSSOP-28]
MOTOR1  22-05-7028-02  [7395-02]
MOTOR2  22-05-7028-02  [7395-02]
MOTOR100  22-05-7028-02  [7395-02]
MOTOR101  22-05-7028-02  [7395-02]
R102  1M  R-US_R0402  [R0402]
R103  0.2  R-US_R0402  [R0402]
R110  10k  R-US_R0402  [R0402]
R111  10k  R-US_R0402  [R0402]
R112  30k  R-US_R0402  [R0402]
R113  1M  R-US_R0402  [R0402]
R114  0.2  R-US_R0402  [R0402]
R118  10k  R-US_R0402  [R0402]
R119  10k  R-US_R0402  [R0402]
R120  30k  R-US_R0402  [R0402]
R121  0.2  R-US_R0402  [R0402]
R122  0.2  R-US_R0402  [R0402]

### Nets
+7V [VM]: C101.2 C102.1 C105.2 C106.1 C107.1 C117.1 C124.+ C135.+ C152.+ IC100.4(VMA) IC100.11(VMB) IC101.4(VMA) IC101.11(VMB) R102.2 R113.2 ; supply symbol labelled +VM ; also sheet 9,10,11
GND: C102.2 C103.2 C106.2 C107.2 C116.2 C117.2 C124.- C135.- C152.- IC100.14(GND) IC100.28(GND) IC100.EXP(GND) IC101.14(GND) IC101.28(GND) IC101.EXP(GND) R103.2 R112.2 R114.2 R120.2 R121.2 R122.2 ; also sheet 1,2,3,4,5,6,7,9,10,11
M1-AENBL: IC101.21(AENBL) ; also sheet 10
M1-APHASE: IC101.20(APHASE) ; also sheet 10
M1-BENBL: IC101.22(BENBL) ; also sheet 10
M1-BHPASE: IC101.23(BHPASE) ; also sheet 10
M1-MAOUT1: IC101.5(AOUT1) MOTOR1.1
M1-MAOUT2: IC101.7(AOUT2) MOTOR1.2
M1-MBOUT1: IC101.10(BOUT1) MOTOR101.1
M1-MBOUT2: IC101.8(BOUT2) MOTOR101.2
M2-AENBL: IC100.21(AENBL) ; also sheet 10
M2-APHASE: IC100.20(APHASE) ; also sheet 10
M2-BENBL: IC100.22(BENBL) ; also sheet 10
M2-BHPASE: IC100.23(BHPASE) ; also sheet 10
M2-MAOUT1: IC100.5(AOUT1) MOTOR2.1
M2-MAOUT2: IC100.7(AOUT2) MOTOR2.2
M2-MBOUT1: IC100.10(BOUT1) MOTOR100.1
M2-MBOUT2: IC100.8(BOUT2) MOTOR100.2
M-DECAY: IC100.19(DECAY) IC101.19(DECAY) ; also sheet 10
M-I0: IC100.24(AI0) IC100.26(BI0) IC101.24(AI0) IC101.26(BI0) ; also sheet 10
M-I1: IC100.25(AI1) IC100.27(BI1) IC101.25(AI1) IC101.27(BI1) ; also sheet 10
M-NSLEEP: IC100.17(NSLEEP) IC101.17(NSLEEP) ; also sheet 9,10
M-RESET: IC100.16(NRESET) IC101.16(NRESET) ; also sheet 9,10
N$4: C104.2 IC101.2(CP2)
N$12: C104.1 IC101.1(CP1)
N$13: C105.1 IC101.3(VCP) R113.1
N$14: IC101.6(ISENA) R121.1
N$15: IC101.9(ISENB) R122.1
N$16: IC101.12(AVREV) IC101.13(BVREF) R118.1 R120.1
N$17: C100.2 IC100.2(CP2)
N$20: C100.1 IC100.1(CP1)
N$21: C101.1 IC100.3(VCP) R102.1
N$22: IC100.6(ISENA) R103.1
N$23: IC100.9(ISENB) R114.1
N$24: IC100.12(AVREV) IC100.13(BVREF) R111.1 R112.1
N$26: IC101.18(NFAULT) R119.1
N$29 [+3v3]: C116.1 IC101.15(V3V3OUT) R118.2 R119.2
N$35: IC100.18(NFAULT) R110.1
N$37 [+3v3]: C103.1 IC100.15(V3V3OUT) R110.2 R111.2

## Sheet 9 of 12
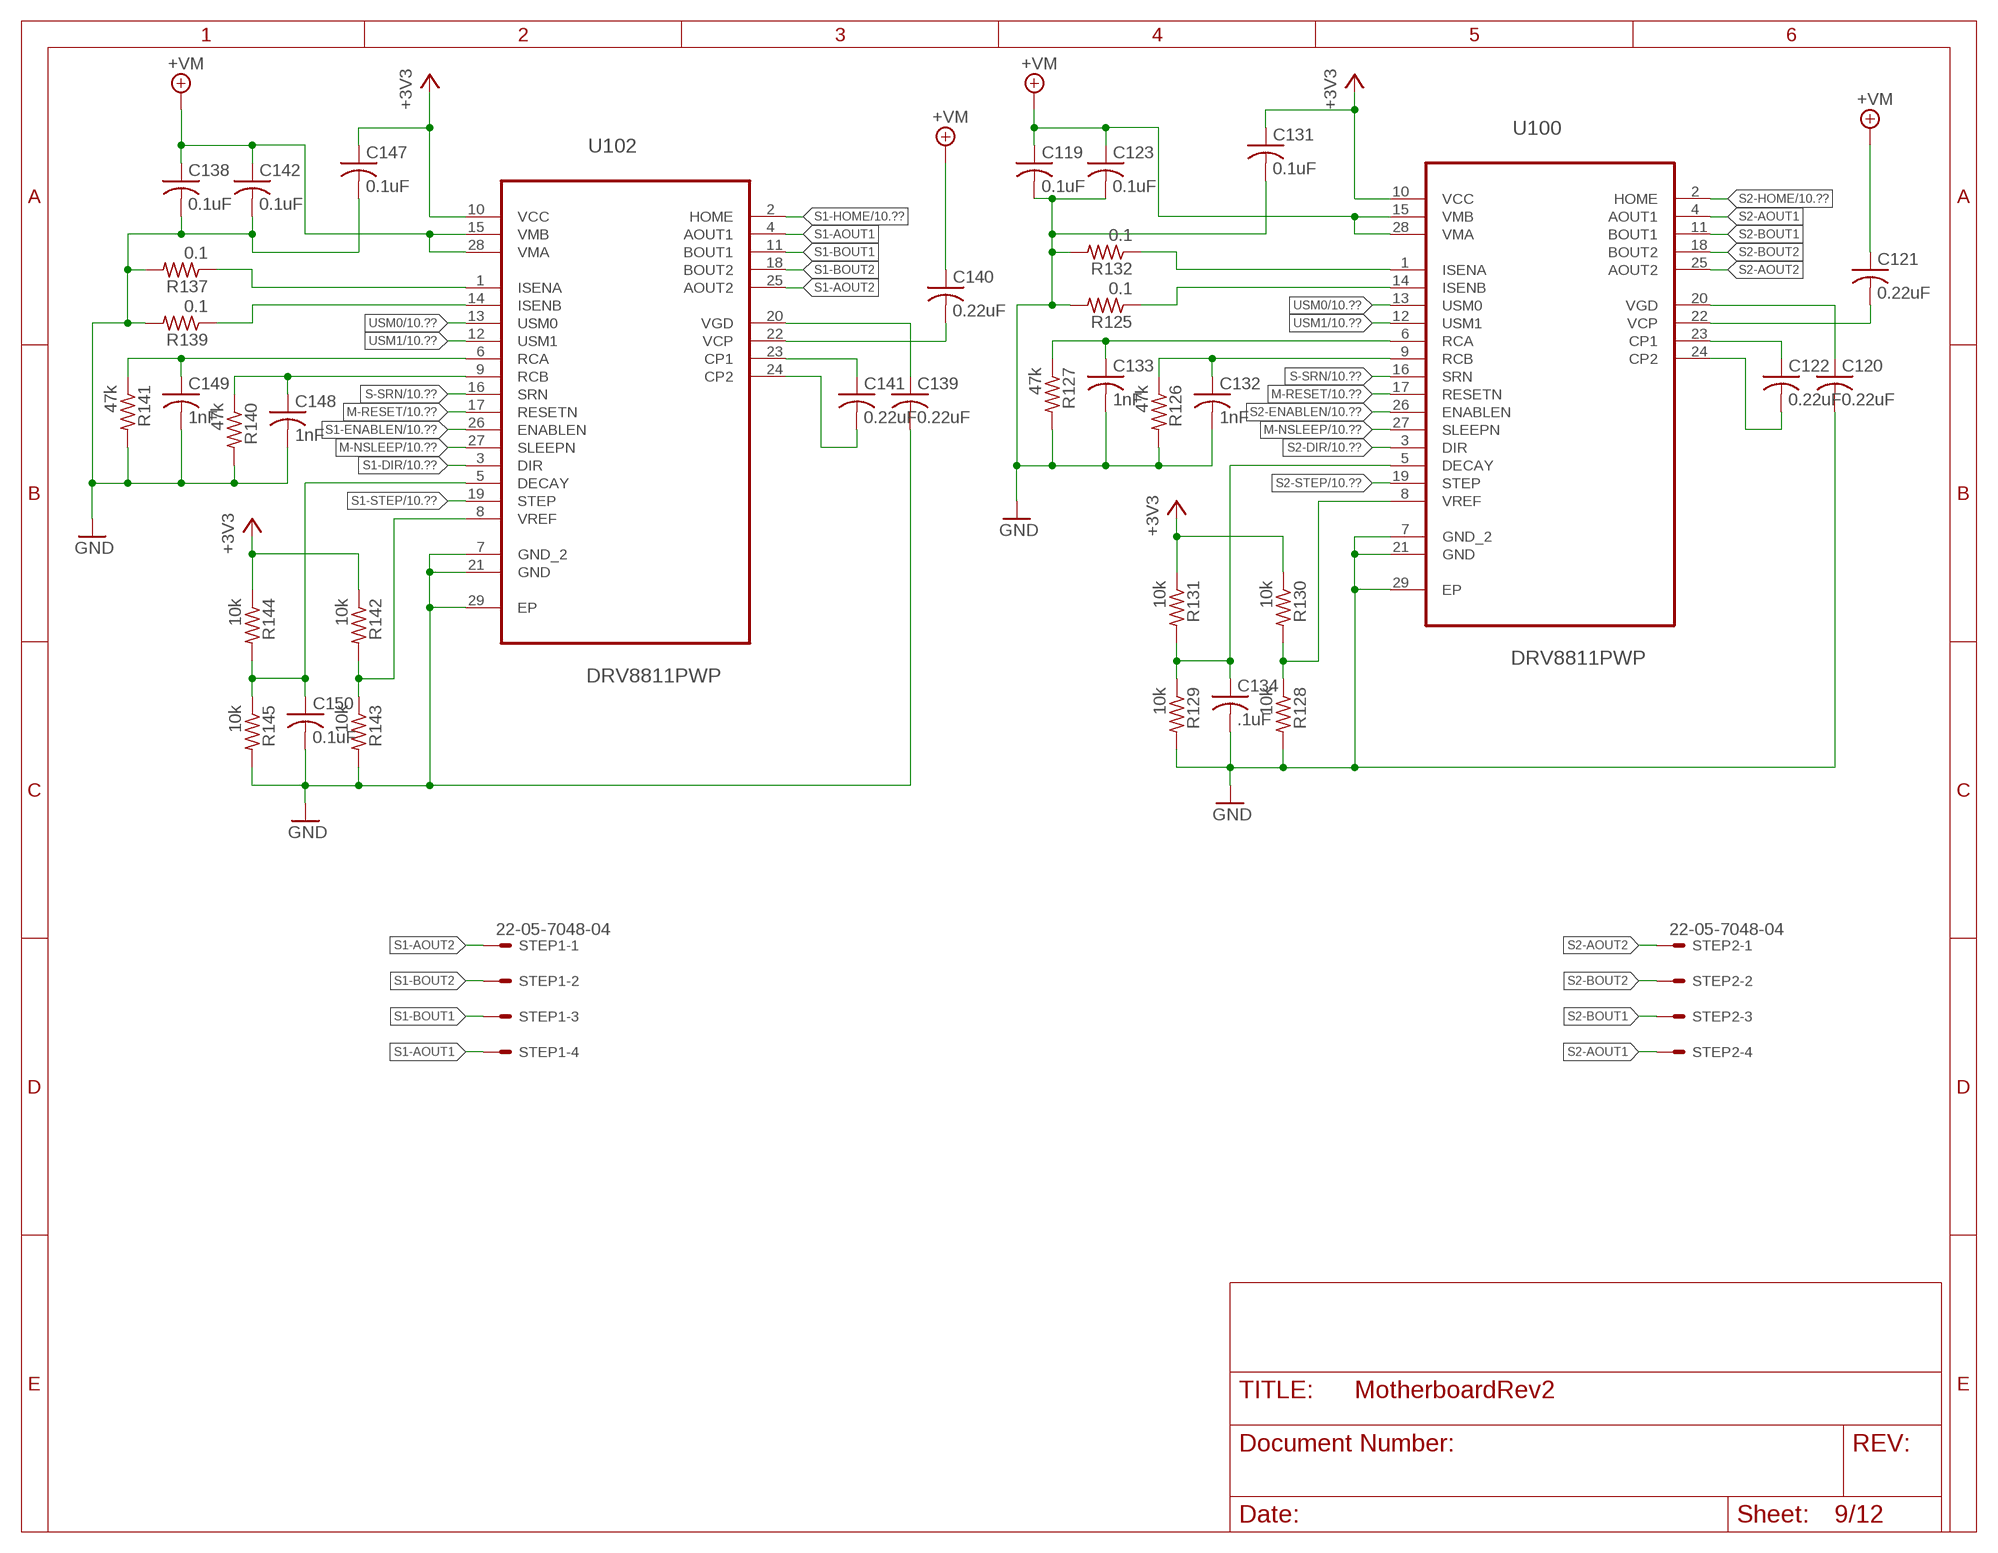
[diagram p8: schematic, sheet 9]

### Parts
C119  0.1uF  C-USC0402  [C0402]
C120  0.22uF  C-USC0402  [C0402]
C121  0.22uF  C-USC0402  [C0402]
C122  0.22uF  C-USC0402  [C0402]
C123  0.1uF  C-USC0402  [C0402]
C131  0.1uF  C-USC0402  [C0402]
C132  1nF  C-USC0402  [C0402]
C133  1nF  C-USC0402  [C0402]
C134  .1uF  C-USC0402  [C0402]
C138  0.1uF  C-USC0402  [C0402]
C139  0.22uF  C-USC0402  [C0402]
C140  0.22uF  C-USC0402  [C0402]
C141  0.22uF  C-USC0402  [C0402]
C142  0.1uF  C-USC0402  [C0402]
C147  0.1uF  C-USC0402  [C0402]
C148  1nF  C-USC0402  [C0402]
C149  1nF  C-USC0402  [C0402]
C150  0.1uF  C-USC0402  [C0402]
R125  0.1  R-US_R0402  [R0402]
R126  47k  R-US_R0402  [R0402]
R127  47k  R-US_R0402  [R0402]
R128  10k  R-US_R0402  [R0402]
R129  10k  R-US_R0402  [R0402]
R130  10k  R-US_R0402  [R0402]
R131  10k  R-US_R0402  [R0402]
R132  0.1  R-US_R0402  [R0402]
R137  0.1  R-US_R0402  [R0402]
R139  0.1  R-US_R0402  [R0402]
R140  47k  R-US_R0402  [R0402]
R141  47k  R-US_R0402  [R0402]
R142  10k  R-US_R0402  [R0402]
R143  10k  R-US_R0402  [R0402]
R144  10k  R-US_R0402  [R0402]
R145  10k  R-US_R0402  [R0402]
STEP1  22-05-7048-04  [7395-04]
STEP2  22-05-7048-04  [7395-04]
U100  DRV8811PWP  [SOP65P640X120-29N]
U102  DRV8811PWP  [SOP65P640X120-29N]

### Nets
3.3V: C131.1 C147.1 R130.1 R131.1 R142.1 R144.1 U100.10(VCC) U102.10(VCC) ; supply symbol labelled +3V3 ; also sheet 1,2,3,10
+7V [VM]: C119.1 C121.1 C123.1 C138.1 C140.1 C142.1 U100.15(VMB) U100.28(VMA) U102.15(VMB) U102.28(VMA) ; supply symbol labelled +VM ; also sheet 8,10,11
GND: C119.2 C120.2 C123.2 C131.2 C132.2 C133.2 C134.2 C138.2 C139.2 C142.2 C147.2 C148.2 C149.2 C150.2 R125.2 R126.2 R127.2 R128.2 R129.2 R132.2 R137.2 R139.2 R140.2 R141.2 R143.2 R145.2 U100.7(GND_2) U100.21(GND) U100.29(EP) U102.7(GND_2) U102.21(GND) U102.29(EP) ; also sheet 1,2,3,4,5,6,7,8,10,11
M-NSLEEP: U100.27(SLEEPN) U102.27(SLEEPN) ; also sheet 8,10
M-RESET: U100.17(RESETN) U102.17(RESETN) ; also sheet 8,10
N$27: R139.1 U102.14(ISENB)
N$28: R137.1 U102.1(ISENA)
N$30: C149.1 R141.1 U102.6(RCA)
N$32: C148.1 R140.1 U102.9(RCB)
N$33: C150.1 R144.2 R145.1 U102.5(DECAY)
N$34: R142.2 R143.1 U102.8(VREF)
N$36: C141.1 U102.23(CP1)
N$38: C141.2 U102.24(CP2)
N$39: C139.1 U102.20(VGD)
N$40: C140.2 U102.22(VCP)
N$41: R125.1 U100.14(ISENB)
N$42: R132.1 U100.1(ISENA)
N$43: C133.1 R127.1 U100.6(RCA)
N$44: C132.1 R126.1 U100.9(RCB)
N$45: C134.1 R129.1 R131.2 U100.5(DECAY)
N$46: R128.1 R130.2 U100.8(VREF)
N$47: C122.1 U100.23(CP1)
N$48: C122.2 U100.24(CP2)
N$49: C120.1 U100.20(VGD)
N$50: C121.2 U100.22(VCP)
S1-AOUT1: STEP1.4 U102.4(AOUT1)
S1-AOUT2: STEP1.1 U102.25(AOUT2)
S1-BOUT1: STEP1.3 U102.11(BOUT1)
S1-BOUT2: STEP1.2 U102.18(BOUT2)
S1-DIR: U102.3(DIR) ; also sheet 10
S1-ENABLEN: U102.26(ENABLEN) ; also sheet 10
S1-HOME: U102.2(HOME) ; also sheet 10
S1-STEP: U102.19(STEP) ; also sheet 10
S2-AOUT1: STEP2.4 U100.4(AOUT1)
S2-AOUT2: STEP2.1 U100.25(AOUT2)
S2-BOUT1: STEP2.3 U100.11(BOUT1)
S2-BOUT2: STEP2.2 U100.18(BOUT2)
S2-DIR: U100.3(DIR) ; also sheet 10
S2-ENABLEN: U100.26(ENABLEN) ; also sheet 10
S2-HOME: U100.2(HOME) ; also sheet 10
S2-STEP: U100.19(STEP) ; also sheet 10
S-SRN: U100.16(SRN) U102.16(SRN) ; also sheet 10
USM0: U100.13(USM0) U102.13(USM0) ; also sheet 10
USM1: U100.12(USM1) U102.12(USM1) ; also sheet 10

## Sheet 10 of 12
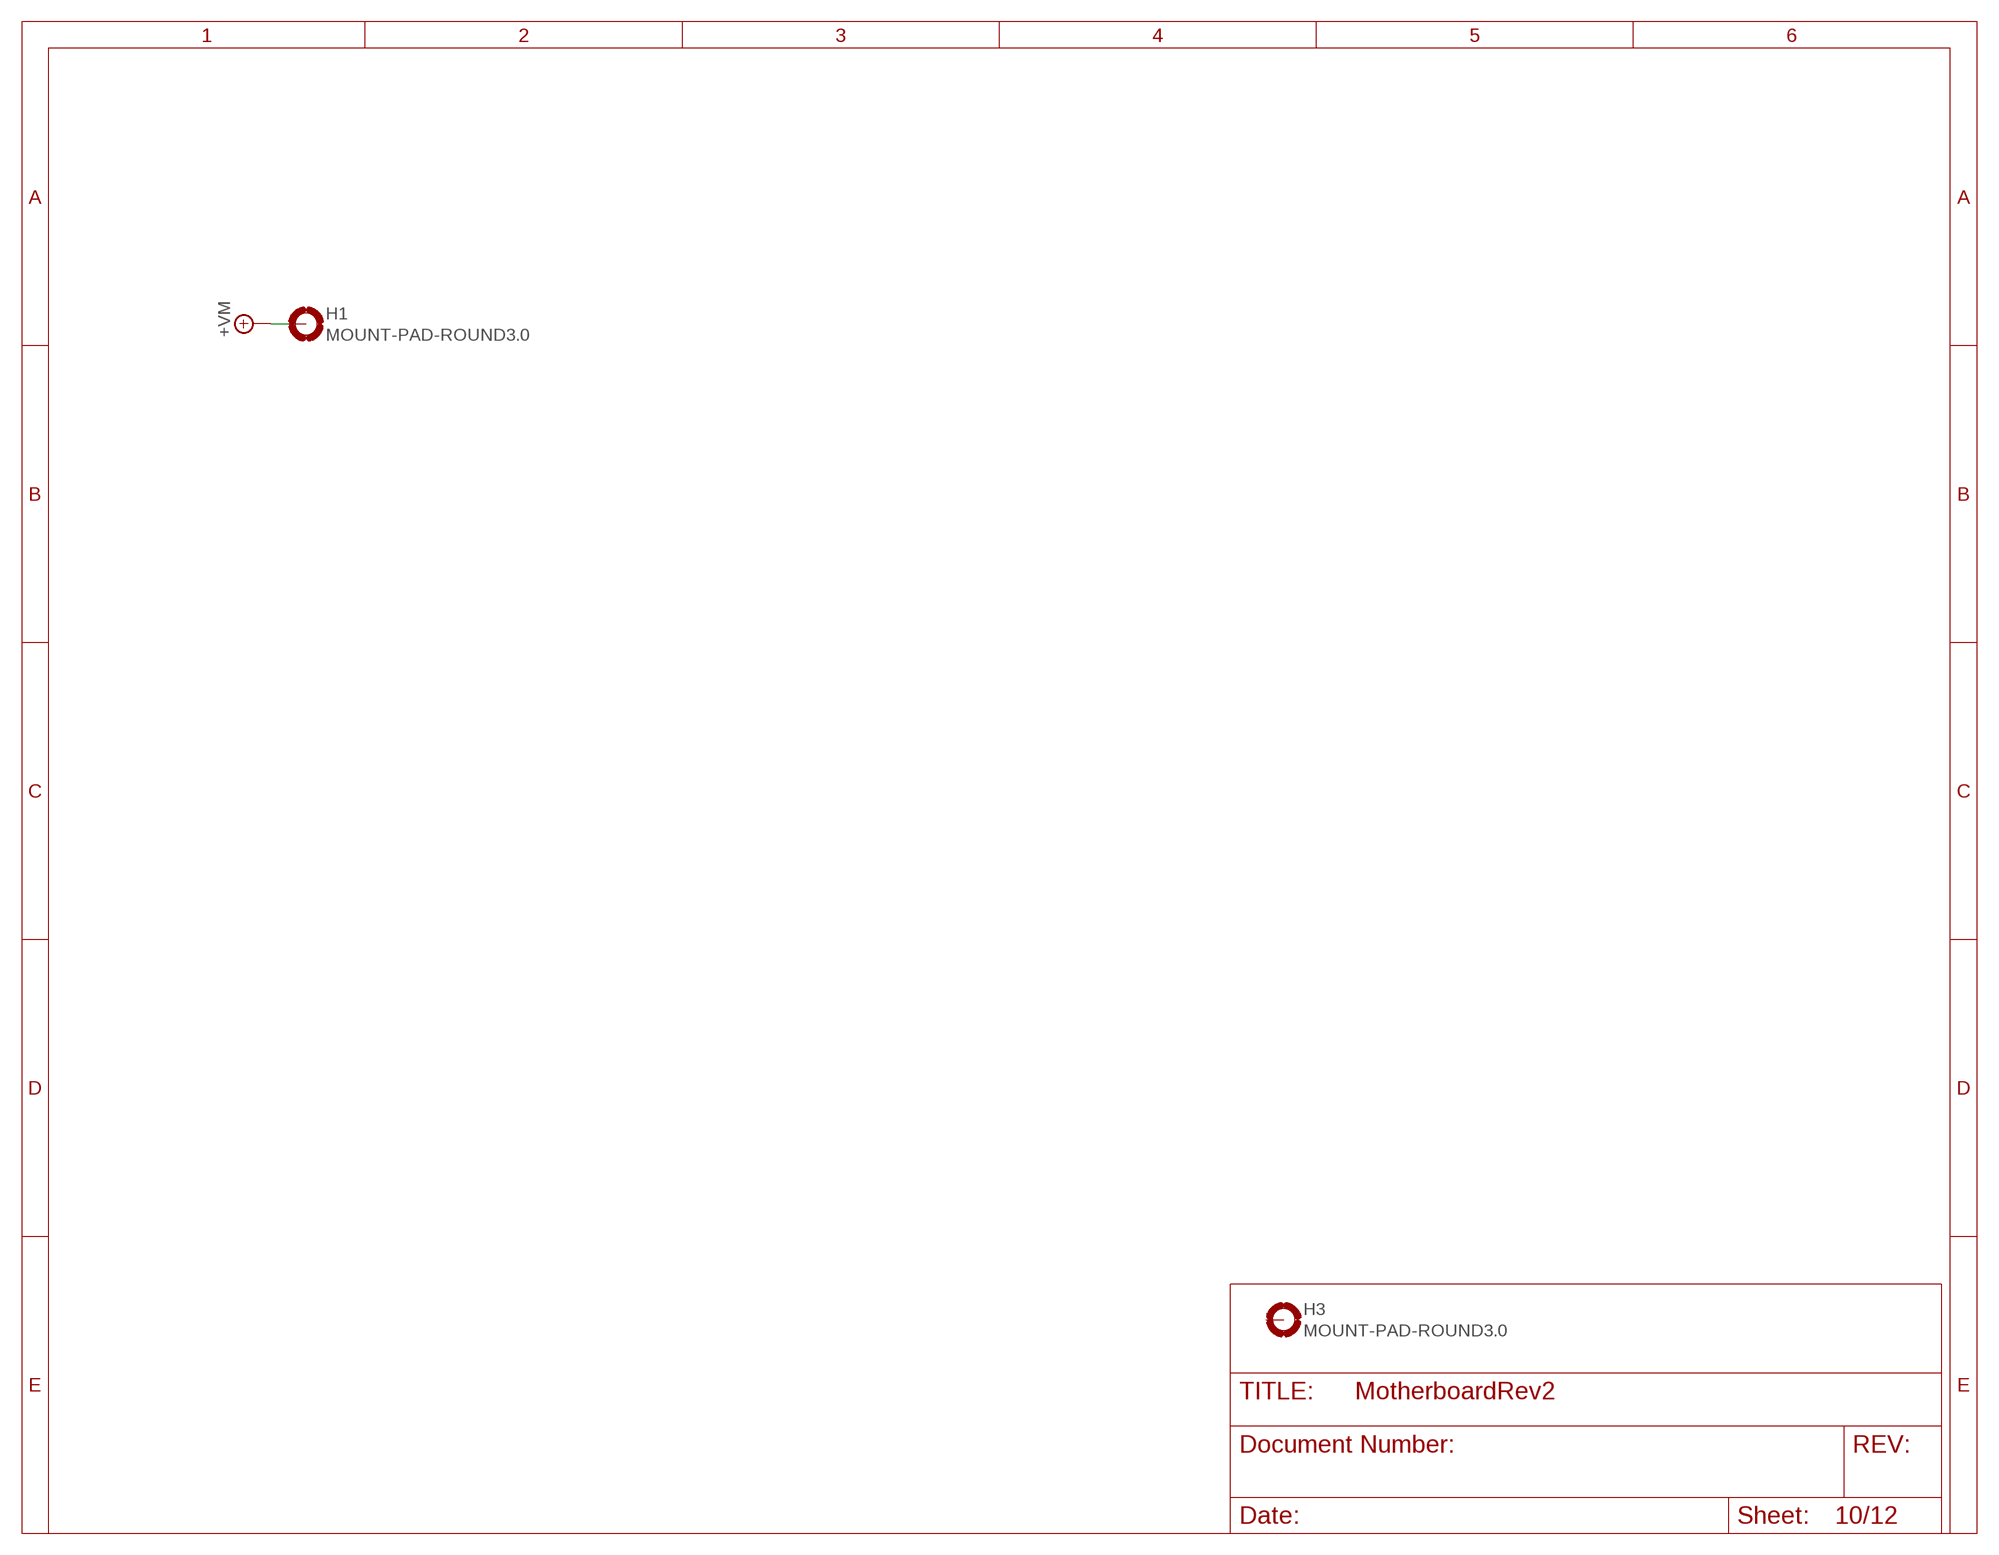
[diagram p9: schematic, sheet 10, part 1 of 2]
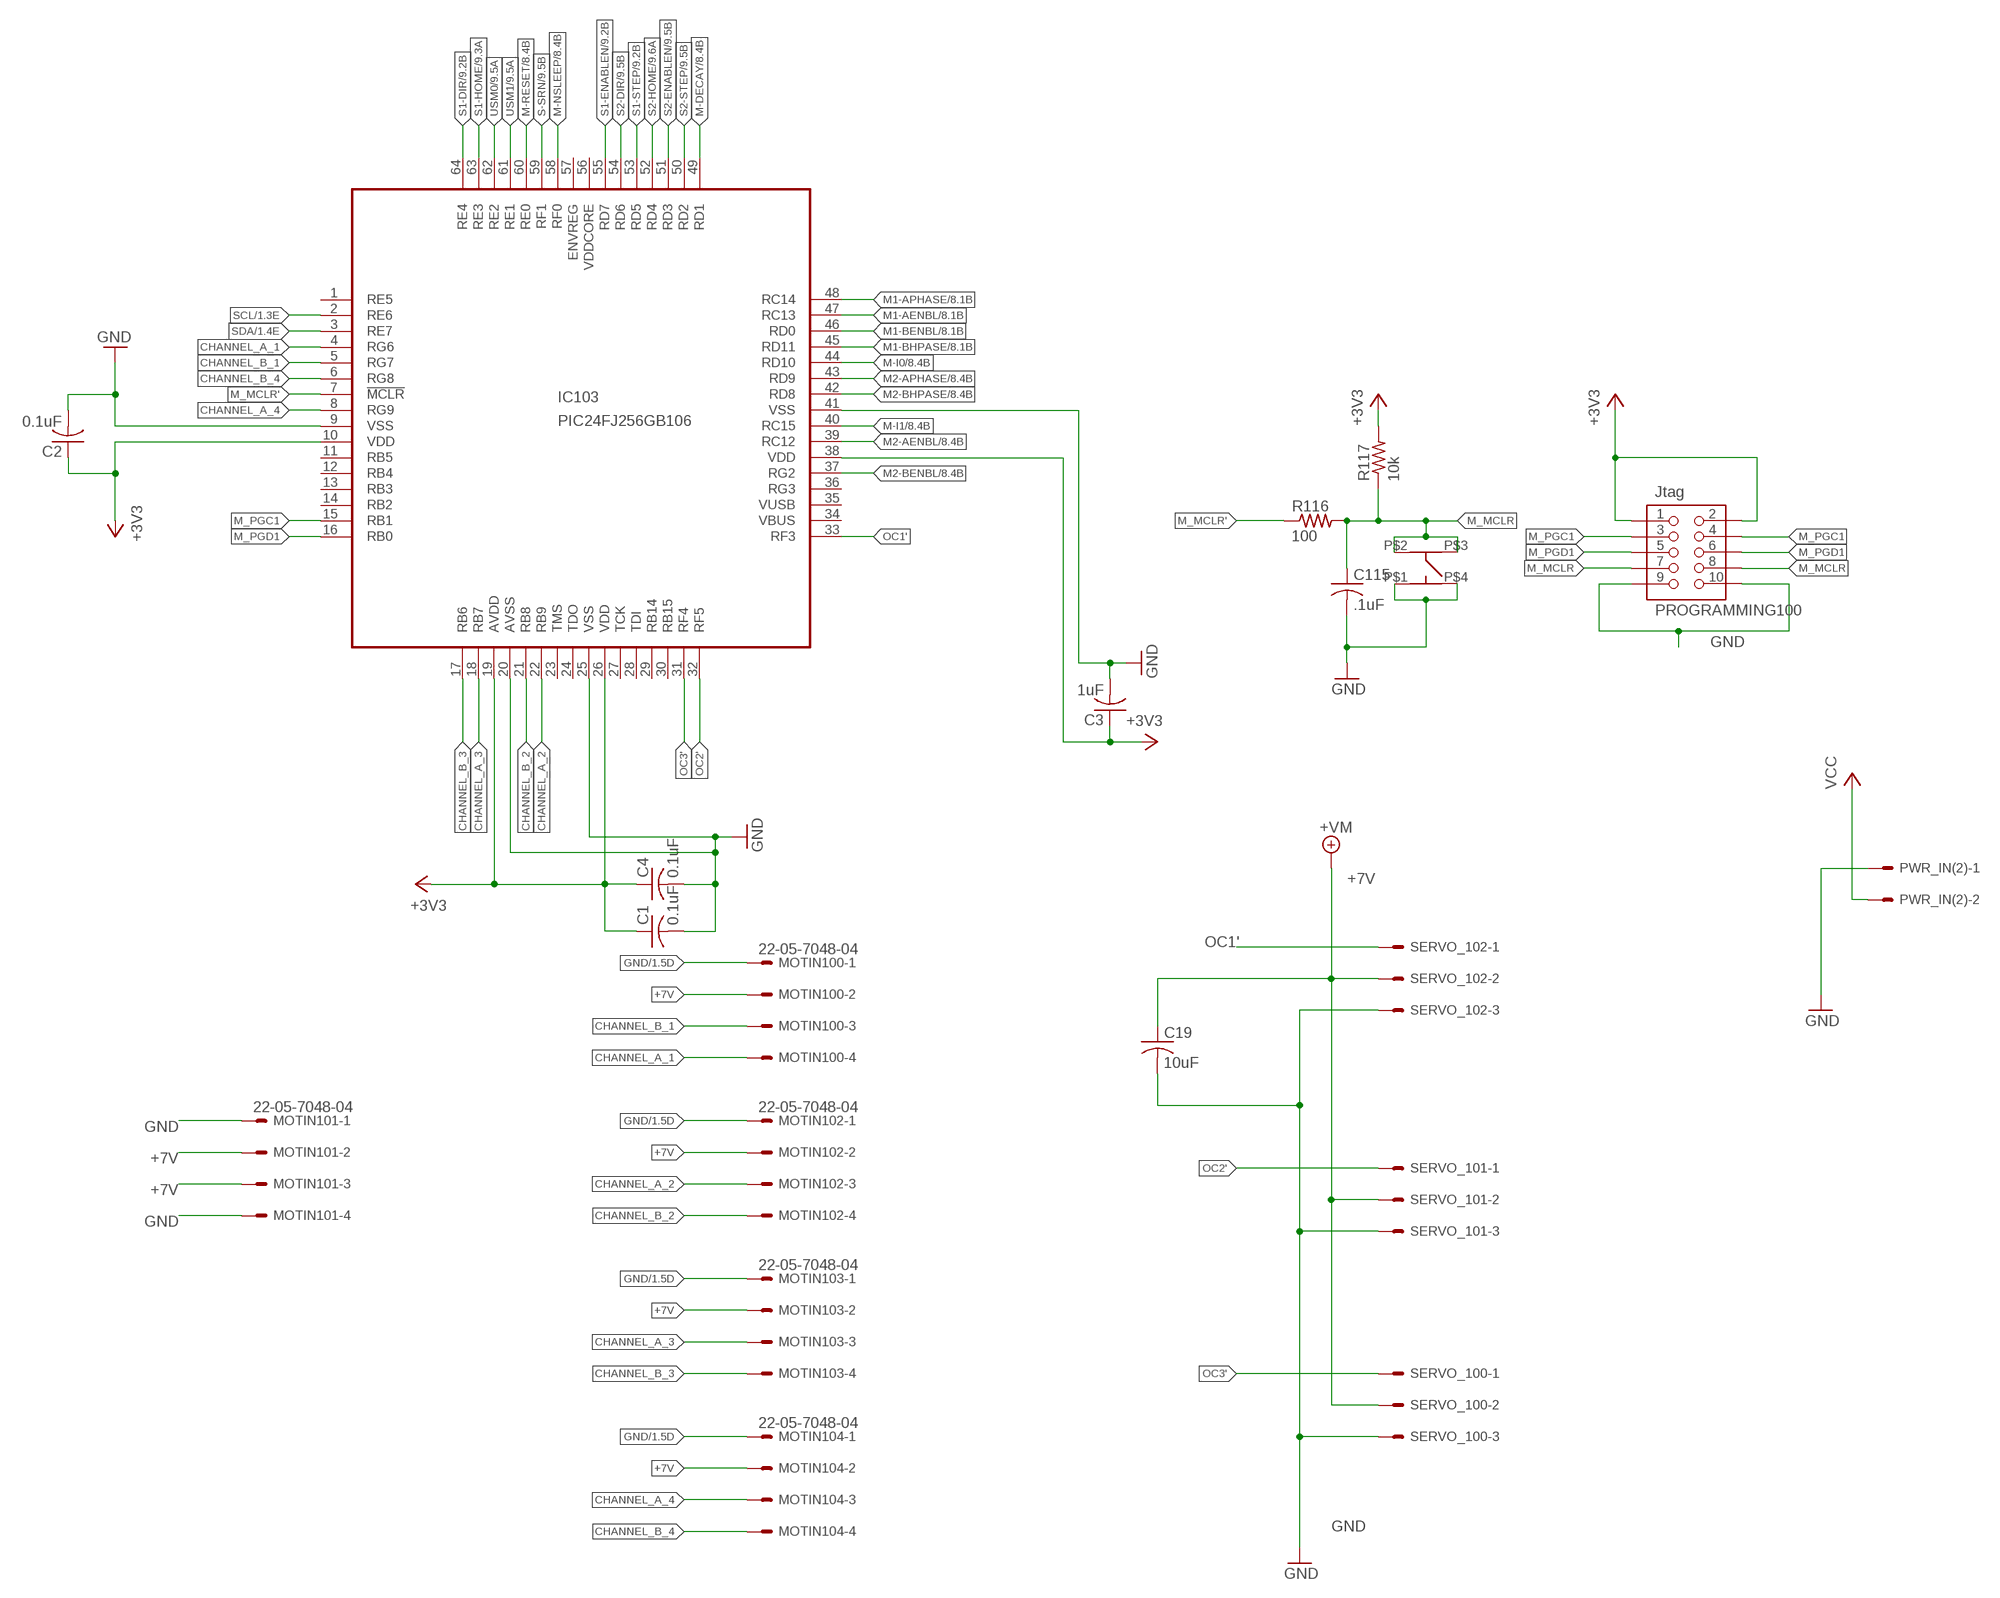
[diagram p10: schematic, sheet 10, part 2 of 2]

### Parts
C1  0.1uF  C-USC0402  [C0402]
C2  0.1uF  C-USC0402  [C0402]
C3  1uF  C-USC0402  [C0402]
C4  0.1uF  C-USC0402  [C0402]
C19  10uF  C-USC0805  [C0805]
C115  .1uF  C-USC0402  [C0402]
H1  MOUNT-PAD-ROUND3.0  [3,0-PAD]
H3  MOUNT-PAD-ROUND3.0  [3,0-PAD]
IC103  PIC24FJ256GB106  [TQFP64-10X10]
MOTIN100  22-05-7048-04  [7395-04]
MOTIN101  22-05-7048-04  [7395-04]
MOTIN102  22-05-7048-04  [7395-04]
MOTIN103  22-05-7048-04  [7395-04]
MOTIN104  22-05-7048-04  [7395-04]
PROGRAMMING100  Jtag  MOTHER-BOARD-REV5_PIN-CONNECTOR74089  [MOTHER-BOARD-REV5_10-PIN-SMD]
PWR_IN(2)  555X-2H  [5569-2]
R116  100  R-US_R0402  [R0402]
R117  10k  R-US_R0402  [R0402]
SERVO_100  22-05-7038-03  [7395-03]
SERVO_101  22-05-7038-03  [7395-03]
SERVO_102  22-05-7038-03  [7395-03]
U$103  Switch3  MC32882_SW  [MC32882_FINAL]

### Nets
3.3V: C1.1 C2.1 C3.1 C4.1 IC103.10(VDD) IC103.19(AVDD) IC103.26(VDD) IC103.38(VDD) PROGRAMMING100.1 PROGRAMMING100.2 R117.2 ; supply symbol labelled +3V3 ; also sheet 1,2,3,9
+7V [VM]: C19.1 H1.B3,0(MOUNT) MOTIN100.2 MOTIN101.2 MOTIN101.3 MOTIN102.2 MOTIN103.2 MOTIN104.2 SERVO_100.2 SERVO_101.2 SERVO_102.2 ; supply symbol labelled +VM ; also sheet 8,9,11
CHANNEL_A_1: IC103.4(RG6) MOTIN100.4
CHANNEL_A_2: IC103.22(RB9) MOTIN102.3
CHANNEL_A_3: IC103.18(RB7) MOTIN103.3
CHANNEL_A_4: IC103.8(RG9) MOTIN104.3
CHANNEL_B_1: IC103.5(RG7) MOTIN100.3
CHANNEL_B_2: IC103.21(RB8) MOTIN102.4
CHANNEL_B_3: IC103.17(RB6) MOTIN103.4
CHANNEL_B_4: IC103.6(RG8) MOTIN104.4
GND: C1.2 C2.2 C3.2 C4.2 C19.2 C115.2 IC103.9(VSS) IC103.20(AVSS) IC103.25(VSS) IC103.41(VSS) MOTIN100.1 MOTIN101.1 MOTIN101.4 MOTIN102.1 MOTIN103.1 MOTIN104.1 PROGRAMMING100.9 PROGRAMMING100.10 PWR_IN(2).1 SERVO_100.3 SERVO_101.3 SERVO_102.3 U$103.P$1(P1) U$103.P$4(P4) ; also sheet 1,2,3,4,5,6,7,8,9,11
M1-AENBL: IC103.47(RC13) ; also sheet 8
M1-APHASE: IC103.48(RC14) ; also sheet 8
M1-BENBL: IC103.46(RD0) ; also sheet 8
M1-BHPASE: IC103.45(RD11) ; also sheet 8
M2-AENBL: IC103.39(RC12) ; also sheet 8
M2-APHASE: IC103.43(RD9) ; also sheet 8
M2-BENBL: IC103.37(RG2) ; also sheet 8
M2-BHPASE: IC103.42(RD8) ; also sheet 8
M-DECAY: IC103.49(RD1) ; also sheet 8
M-I0: IC103.44(RD10) ; also sheet 8
M-I1: IC103.40(RC15) ; also sheet 8
M-NSLEEP: IC103.58(RF0) ; also sheet 8,9
M-RESET: IC103.60(RE0) ; also sheet 8,9
M_MCLR: C115.1 PROGRAMMING100.7 PROGRAMMING100.8 R116.2 R117.1 U$103.P$2(P2) U$103.P$3(P3)
M_MCLR': IC103.7(!MCLR) R116.1
M_PGC1: IC103.15(RB1) PROGRAMMING100.3 PROGRAMMING100.4
M_PGD1: IC103.16(RB0) PROGRAMMING100.5 PROGRAMMING100.6
OC1': IC103.33(RF3) SERVO_102.1
OC2': IC103.32(RF5) SERVO_101.1
OC3': IC103.31(RF4) SERVO_100.1
S1-DIR: IC103.64(RE4) ; also sheet 9
S1-ENABLEN: IC103.55(RD7) ; also sheet 9
S1-HOME: IC103.63(RE3) ; also sheet 9
S1-STEP: IC103.53(RD5) ; also sheet 9
S2-DIR: IC103.54(RD6) ; also sheet 9
S2-ENABLEN: IC103.51(RD3) ; also sheet 9
S2-HOME: IC103.52(RD4) ; also sheet 9
S2-STEP: IC103.50(RD2) ; also sheet 9
S-SRN: IC103.59(RF1) ; also sheet 9
SCL: IC103.2(RE6) ; also sheet 1,2
SDA: IC103.3(RE7) ; also sheet 1,2
USM0: IC103.62(RE2) ; also sheet 9
USM1: IC103.61(RE1) ; also sheet 9
VCC: PWR_IN(2).2 ; also sheet 4,5,6,7,11
Unconnected: H3.B3,0(MOUNT) IC103.1(RE5) IC103.11(RB5) IC103.12(RB4) IC103.13(RB3) IC103.14(RB2) IC103.23(TMS) IC103.24(TDO) IC103.27(TCK) IC103.28(TDI) IC103.29(RB14) IC103.30(RB15) IC103.34(VBUS) IC103.35(VUSB) IC103.36(RG3) IC103.57(ENVREG)

## Sheet 11 of 12
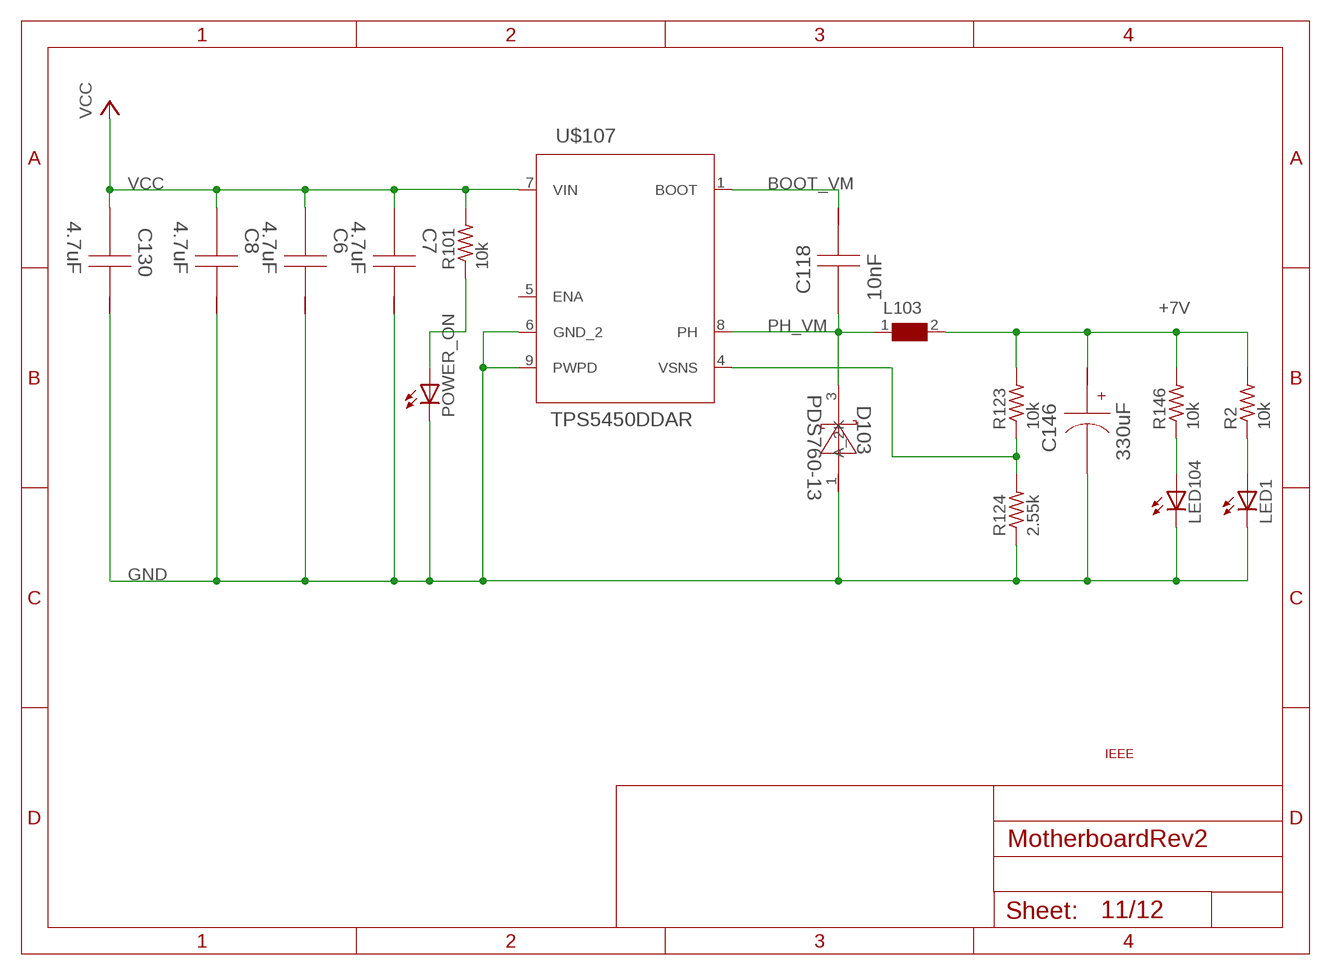
[diagram p11: schematic, sheet 11]

### Parts
C6  4.7uF  GRM31CR71H475KA12L  [1206]
C7  4.7uF  GRM31CR71H475KA12L  [1206]
C8  4.7uF  GRM31CR71H475KA12L  [1206]
C118  10nF  C0805C103K5RACTU  [0805]
C130  4.7uF  GRM31CR71H475KA12L  [1206]
C146  330uF  10SVP330MX  [SM_RADIAL_10AMM]
D103  PDS760-13  [POWERDI5]
L103  WE-HCC-7443331000_1090  [WE-HCC_1090]
LED1  LEDCHIP-LED0603  [CHIP-LED0603]
LED104  LEDCHIP-LED0603  [CHIP-LED0603]
POWER_ON  LEDCHIP-LED0603  [CHIP-LED0603]
R2  10k  R-US_R0402  [R0402]
R101  10k  R-US_R0402  [R0402]
R123  10k  R-US_R0402  [R0402]
R124  2.55k  R-US_R0402  [R0402]
R146  10k  R-US_R0402  [R0402]
U$1  LOGO  [LOGO]
U$107  TPS5450DDAR  [R-PDSO-G8]

### Nets
+7V [VM]: C146.1(+) L103.2 R2.2 R123.2 R146.2 ; also sheet 8,9,10
BOOT_VM: C118.1 U$107.1(BOOT)
GND: C6.1 C7.1 C8.1 C130.1 C146.2(-) D103.1(A_2) LED1.C LED104.C POWER_ON.C R124.1 U$107.6(GND_2) U$107.9(PWPD) ; also sheet 1,2,3,4,5,6,7,8,9,10
N$51: LED104.A R146.1
N$52: POWER_ON.A R101.1
N$63: LED1.A R2.1
PH_VM: C118.2 D103.3(K) L103.1 U$107.8(PH)
VCC: C6.2 C7.2 C8.2 C130.2 R101.2 U$107.7(VIN) ; also sheet 4,5,6,7,10
VSNS_VM: R123.1 R124.2 U$107.4(VSNS)
Unconnected: U$107.5(ENA)

## Sheet 12 of 12

## Power pins joined to a net without a drawn wire
VDDCORE: IC103.56(VDDCORE)

## Library data of the parts
3.3V 3.3V1 3.3V(2) 3.3V(2)1 5V 5V1 5V(2) 5V(2)1 = Son_of_Dark_Powersch:22-?-02: CONNECTOR wire to board 2.54 mm (.1 inch) pitch header; OC_FARNELL: 9731601; OC_NEWARK: unknown
C1-C5 C9-C19 C100-C107 C109 C111 C113-C117 C119-C123 C128 C129 C131-C134 C138-C144 C147-C150 = rcl:C-US: CAPACITOR, American symbol
C6-C8 C130 = 5v:GRM31CR71H475KA12L; CAP: 4.7E-6; ESR: 0.0; IRMS: 0.0; MANUFACTURER_NAME: MuRata; MANUFACTURER_PART_NUMBER: GRM31CR71H475KA12L; VDC: 50.0; VENDOR: MuRata
C108 C110 C112 C118 = 5v:C0805C103K5RACTU; CAP: 1.0E-8; ESR: 1.739; IRMS: 0.411; MANUFACTURER_NAME: Kemet; MANUFACTURER_PART_NUMBER: C0805C103K5RACTU; VDC: 50.0; VENDOR: Kemet
C124 C135 C152 = rcl:CPOL-US: POLARIZED CAPACITOR, American symbol
C125-C127 C146 = 5v:10SVP330MX; CAP: 3.3E-4; DATASHEETURL: http://www.edc.sanyo.com/english/pdf/oscon/E32.pdf; ESR: 0.025; IRMS: 3.7; MANUFACTURER_NAME: Panasonic; MANUFACTURER_PART_NUMBER: 10SVP330MX; VDC: 10.0; VENDOR: Panasonic
C136 C137 C145 C151 = SparkFun-Capacitors:10UF-16V-10%(TANT): CAP-00811 1206/EIA-3216 Tantalum capacitor; PROD_ID: CAP-00811
D1 D2 LED1-LED14 LED100-LED104 POWER_ON = led:LED: LED OSRAM: - CHIPLED LG R971, LG N971, LY N971, LG Q971, LY Q971, LO R971, LY R971 LH N974, LH R974 LS Q976, LO Q976, LY Q976 LO Q996 - Hyper CHIPLED LW Q18S LB Q993, LB Q99A, LB R99A - SideLED LS A670, LO A670, LY A670, LG A670, LP A670 LB A673, LV A673, LT A673, LW A673 LH A674 LY A675 LS A676, LA A676, LO A676, LY A676, LW A676 LS A679, LY A679, LG A679 - Hyper Micro SIDELED® LS Y876, LA Y876, LO Y876, LY Y876 LT Y87S - SmartLED LW L88C, LW L88S LB L89C, LB L89S, LG L890 LS L89K, LO L89K, LY L89K LS L896, LA L896, LO L896, LY L896 - TOPLED LS T670, LO T670, LY T670, LG T670, LP T670 LSG T670, LSP T670, LSY T670, LOP T670, LYG T670 LG T671, LOG T671, LSG T671 LB T673, LV T673, LT T673, LW T673 LH T674 LS T676, LA T676, LO T676, LY T676, LB T676, LH T676, LSB T676, LW T676 LB T67C, LV T67C, LT T67C, LS T67K, LO T67K, LY T67K, LW E67C LS E67B, LA E67B, LO E67B, LY E67B, LB E67C, LV E67C, LT E67C LW T67C LS T679, LY T679, LG T679 LS T770, LO T770, LY T770, LG T770, LP T770 LB T773, LV T773, LT T773, LW T773 LH T774 LS E675, LA E675, LY E675, LS T675 LS T776, LA T776, LO T776, LY T776, LB T776 LHGB T686 LT T68C, LB T68C - Hyper Mini TOPLED® LB M676 - Mini TOPLED Santana® LG M470 LS M47K, LO M47K, LY M47K Source: http://www.osram.convergy.de LUXEON: - LUMILED® LXK2-PW12-R00, LXK2-PW12-S00, LXK2-PW14-U00, LXK2-PW14-V00 LXK2-PM12-R00, LXK2-PM12-S00, LXK2-PM14-U00 LXK2-PE12-Q00, LXK2-PE12-R00, LXK2-PE12-S00, LXK2-PE14-T00, LXK2-PE14-U00 LXK2-PB12-K00, LXK2-PB12-L00, LXK2-PB12-M00, LXK2-PB14-N00, LXK2-PB14-P00, LXK2-PB14-Q00 LXK2-PR12-L00, LXK2-PR12-M00, LXK2-PR14-Q00, LXK2-PR14-R00 LXK2-PD12-Q00, LXK2-PD12-R00, LXK2-PD12-S00 LXK2-PH12-R00, LXK2-PH12-S00 LXK2-PL12-P00, LXK2-PL12-Q00, LXK2-PL12-R00 Source: www.luxeon.com KINGBRIGHT: KA-3528ASYC Source: www.kingbright.com
D100-D103 = 5v:PDS760-13; DATASHEETURL: www.diodes.com/datasheets/ds30477.pdf; IO: 7.0; MANUFACTURER_NAME: Diodes Inc.; MANUFACTURER_PART_NUMBER: PDS760-13; VENDOR: Diodes Inc.; VFATIO: 0.56; VRRM: 60.0
H1-H4 = holes:MOUNT-PAD-ROUND: MOUNTING PAD, round
IC100 IC101 = Motor-Board:DRV8818PWPR: Driver controlador de motor en paquete HTSSOP
IC102 = microchip:PIC18F2*J53: PIC18F47J53 Family High-Performance USB Microcontrollers with nanoWatt XLP Technology Source: Data sheet <http://ww1.microchip.com/downloads/en/DeviceDoc/39964B.pdf>; MPN: PIC18F26J53-I/ML; OC_FARNELL: unknown; OC_NEWARK: 63R7829
IC103 = microchip:PIC24FJ256GB106: PIC24FJ256GB106 edit this description Auto generated by make-symbol-device-package-bsdl.ulp Rev. 25 Source: PIC24FJ256GB106.bsd; MPN: PIC24FJ256GB106-I/PT; OC_FARNELL: 1576868; OC_NEWARK: 54M5129
L100-L103 = WE-HCC:WE-HCC: SMD High Current Cube Inductor WE-HCC - magnetically shieled - current capability up to 27A - excellent saturation characteristics -- filter choke for DC/DC converter -- single and polyphase buck converter -- filter choke for motor electronics; MPN: 7443331000; OC_FARNELL: 1848254; OC_NEWARK: 13T9771; PACKAGE: 1090; SUPPLIER: Wuerth Elektronik
LIDAR = con-lstb:MA04-1: PIN HEADER; OC_FARNELL: unknown; OC_NEWARK: unknown
MOTIN100-MOTIN104 STEP1 STEP2 = Son_of_Dark_Power:22-?-04: CONNECTOR wire to board 2.54 mm (.1 inch) pitch header; OC_FARNELL: unknown; OC_NEWARK: unknown
MOTOR1 MOTOR2 MOTOR100 MOTOR101 = Son_of_Dark_Power:22-?-02: CONNECTOR wire to board 2.54 mm (.1 inch) pitch header; OC_FARNELL: 9731601; OC_NEWARK: unknown
PROGRAMMING PROGRAMMING100 = Mother-Board-rev5:MOTHER-BOARD-REV5_PIN-CONNECTOR
PWR_IN PWR_IN(2) = Son_of_Dark_Powersch:555X-2: Mini FIT connector 2 way
R1-R23 R100-R146 = rcl:R-US_: RESISTOR, American symbol
SERVO_100-SERVO_108 = con-molex:22-?-03: CONNECTOR wire to board 2.54 mm (.1 inch) pitch header; OC_FARNELL: unknown; OC_NEWARK: unknown
START_SWITCH = con-lstb:MA03-1: PIN HEADER; OC_FARNELL: unknown; OC_NEWARK: unknown
U100 U102 = Texas Instruments_By_element14_Batch_1:DRV8811PWP: STEPPER MOTOR CONTROLLER IC; MPN: DRV8811PWP; OC_FARNELL: 1754829; OC_NEWARK: 24R9116; PACKAGE: HTSSOP-28; SUPPLIER: Texas Instruments
U101 U103 = NSC-LMS8117AMP:LMS8117AMP-3.3: Low-Dropout Linear Regulator; MPN: LMS8117AMP-3.3; OC_FARNELL: 1469032; OC_NEWARK: 41K3020; PACKAGE: SOT-223-3; SUPPLIER: National Semiconductor
U$1 = logo:LOGO
U$3 U$4 U$100-U$103 = Parts4Class:MC32882_SW
U$5 = Son_of_Dark_Powersch:BEAGLE_BONE_BLACK_CAPE
U$104-U$107 = 5v:TPS5450DDAR; DATASHEETURL: http://www.ti.com/product/tps5450; FREQUENCY: 500000.0; IMAX: 5.0; MANUFACTURER_NAME: Texas Instruments; MANUFACTURER_PART_NUMBER: TPS5450DDA; MKTG_PACKAGE: TPS5450; NSID: TPS5450DDAR; PACKAGE: TPS5450; VENDOR: Texas Instruments

## Net classes
0 default: width 0.203 mm, drill 0.33 mm, clearance 0.254 mm
1 +3v3: width 0.406 mm, drill 0.457 mm, clearance 0.254 mm
2 VM: width 0.508 mm, drill 0.533 mm, clearance 0.254 mm